# EAGLE board OpenWest 2015 (EAGLE 7.2.0), part 1 of 2
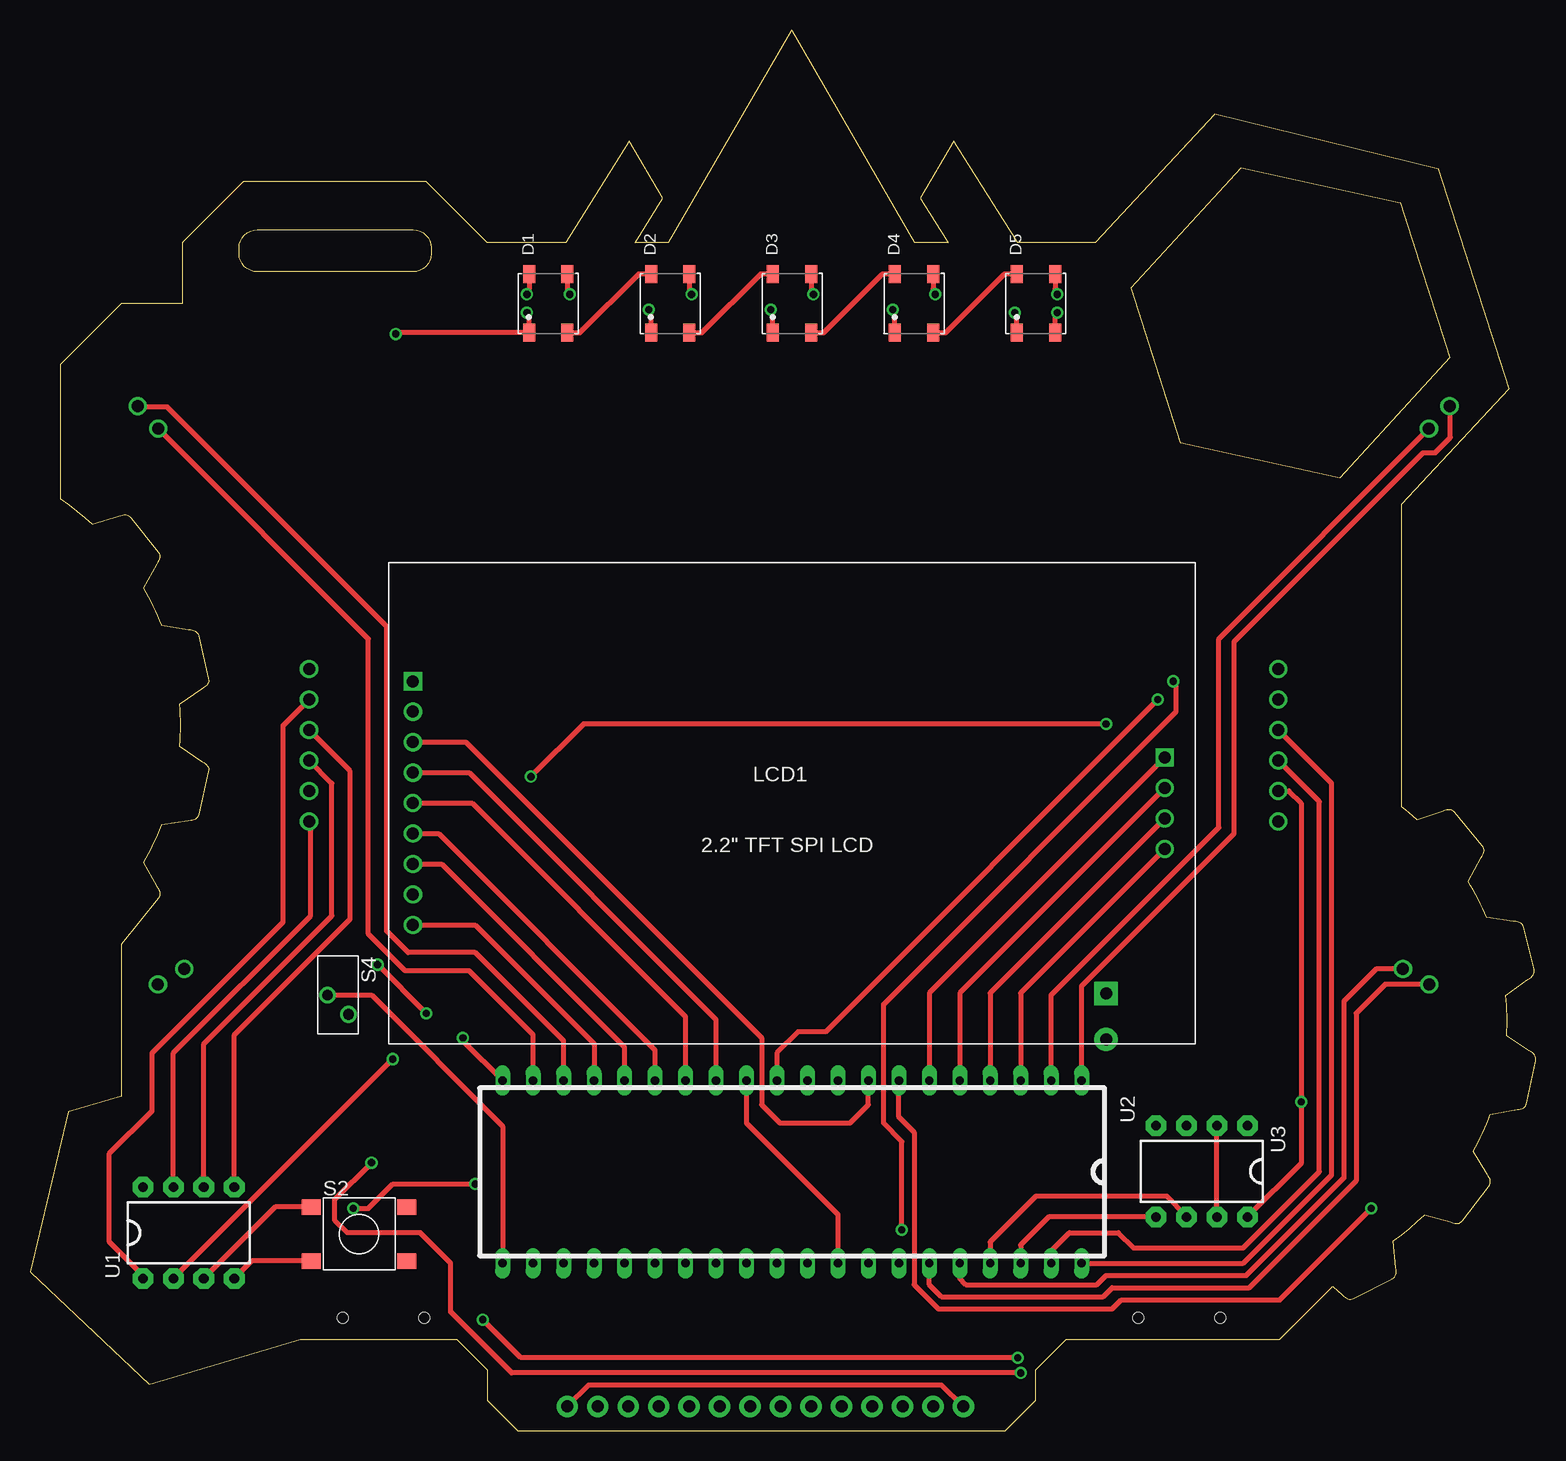
[diagram p1: board, top side]
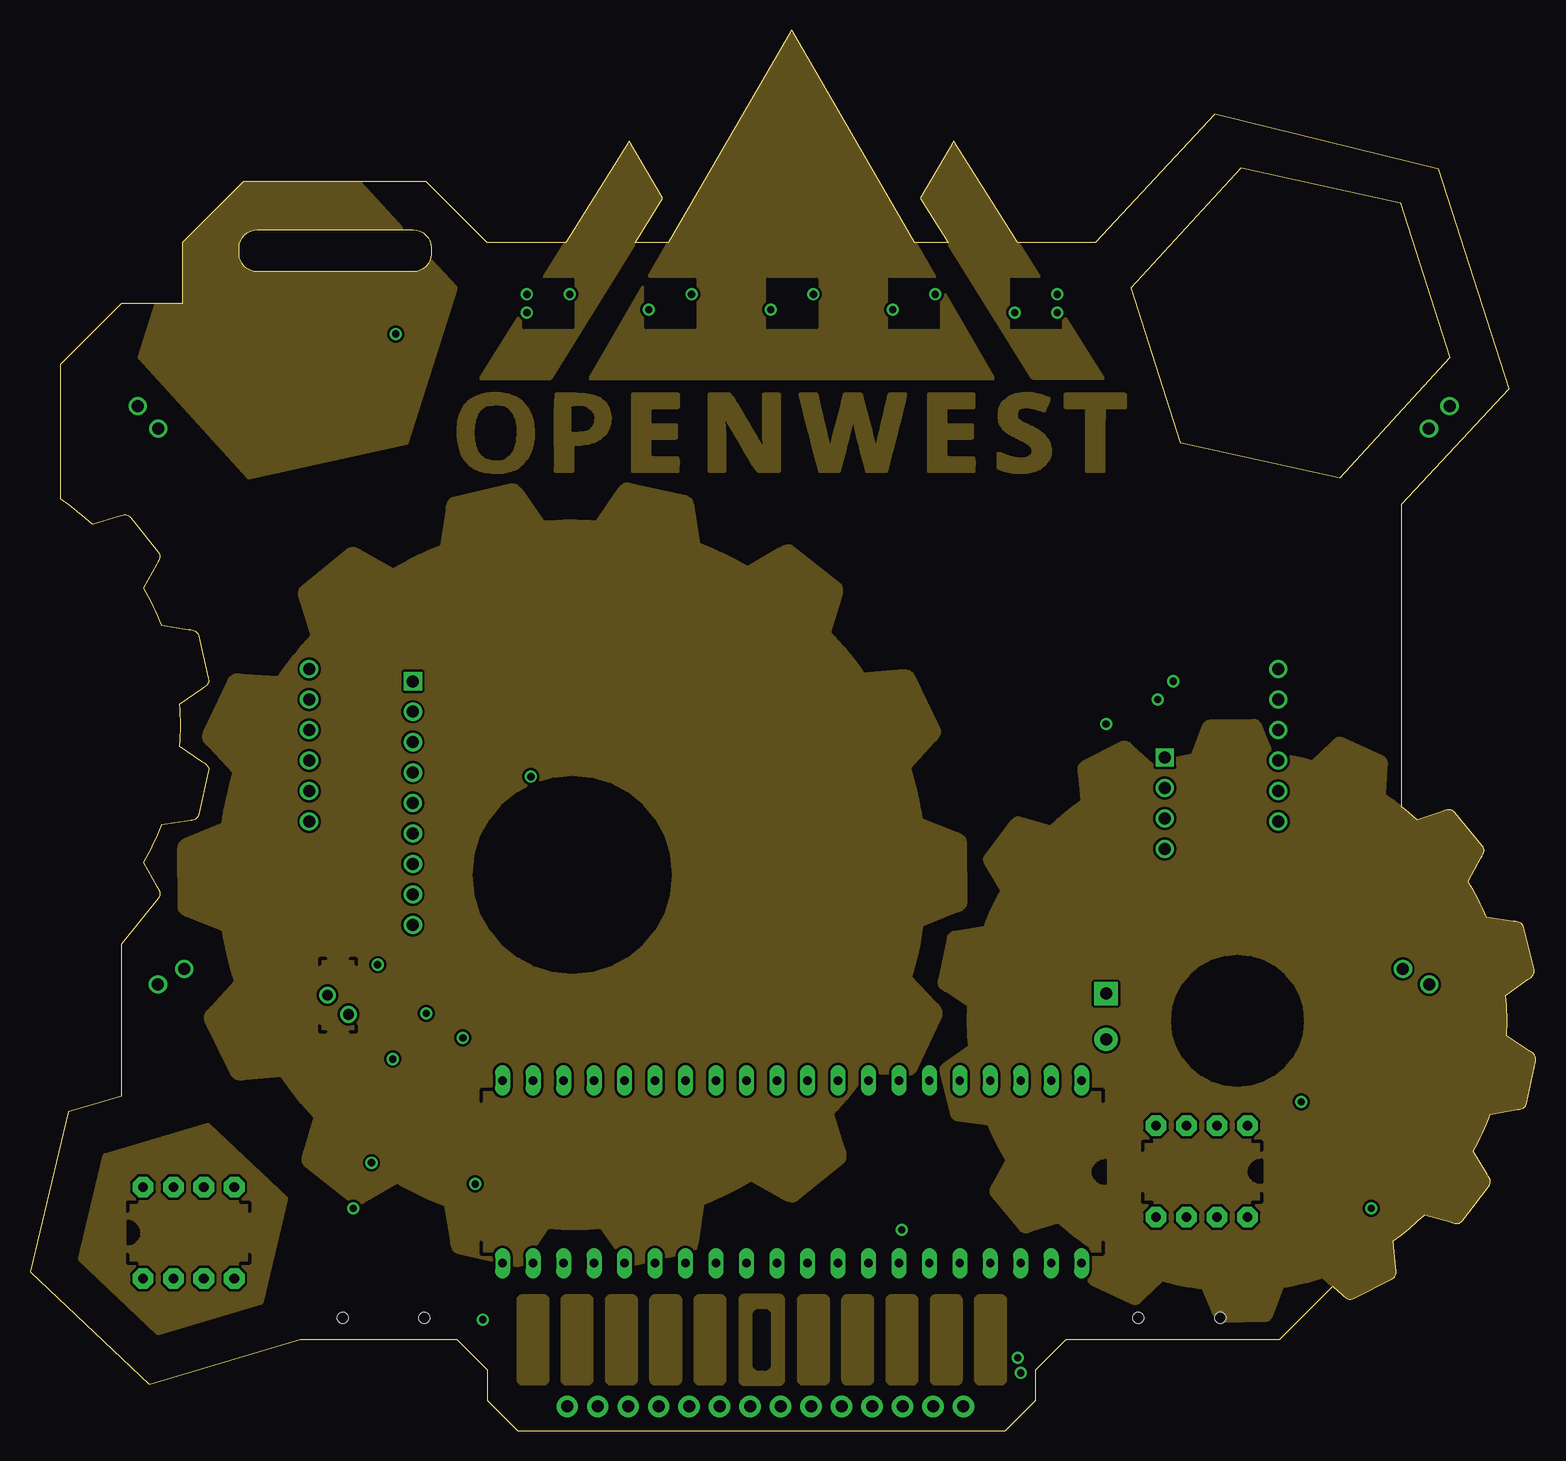
[diagram p2: board, inner layer Route2]
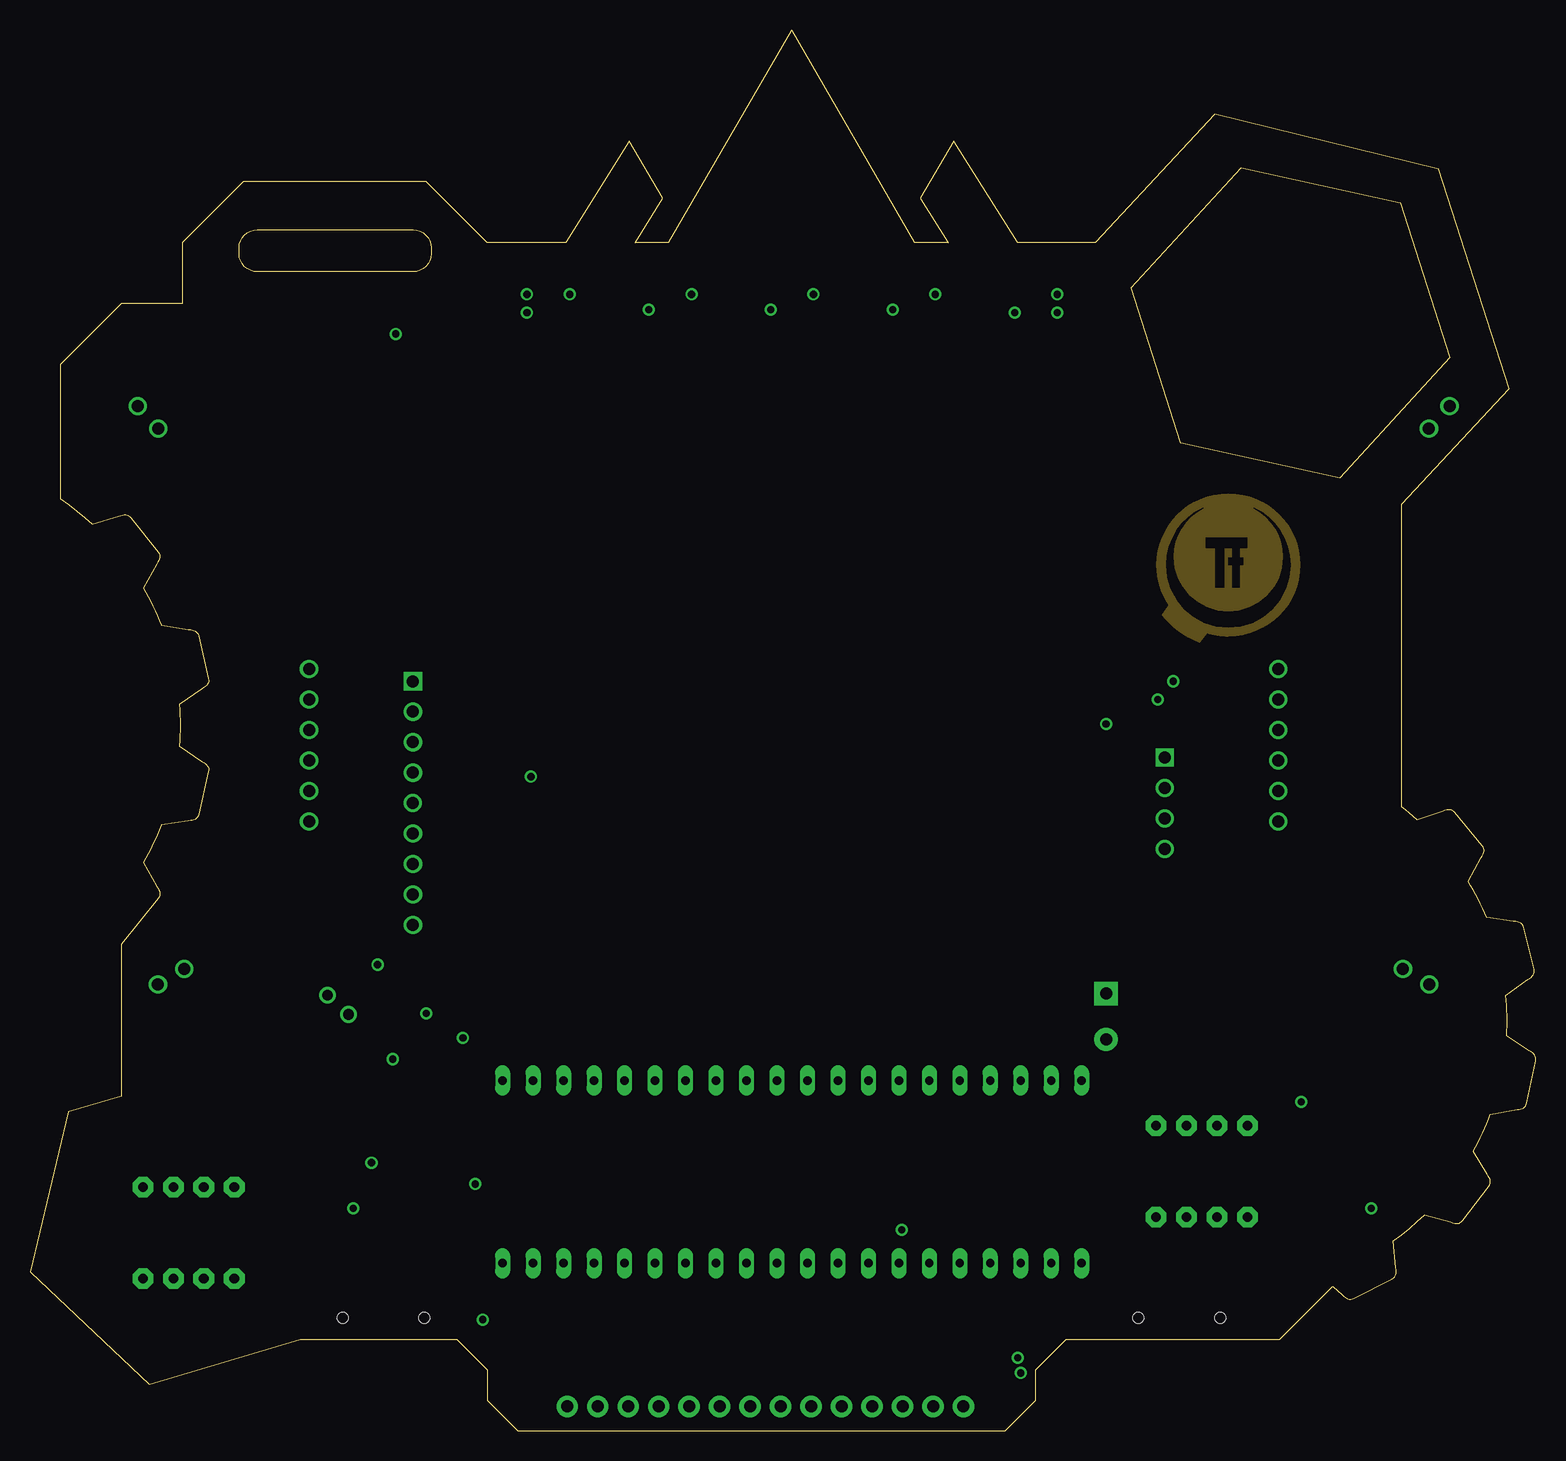
[diagram p3: board, inner layer Route14]
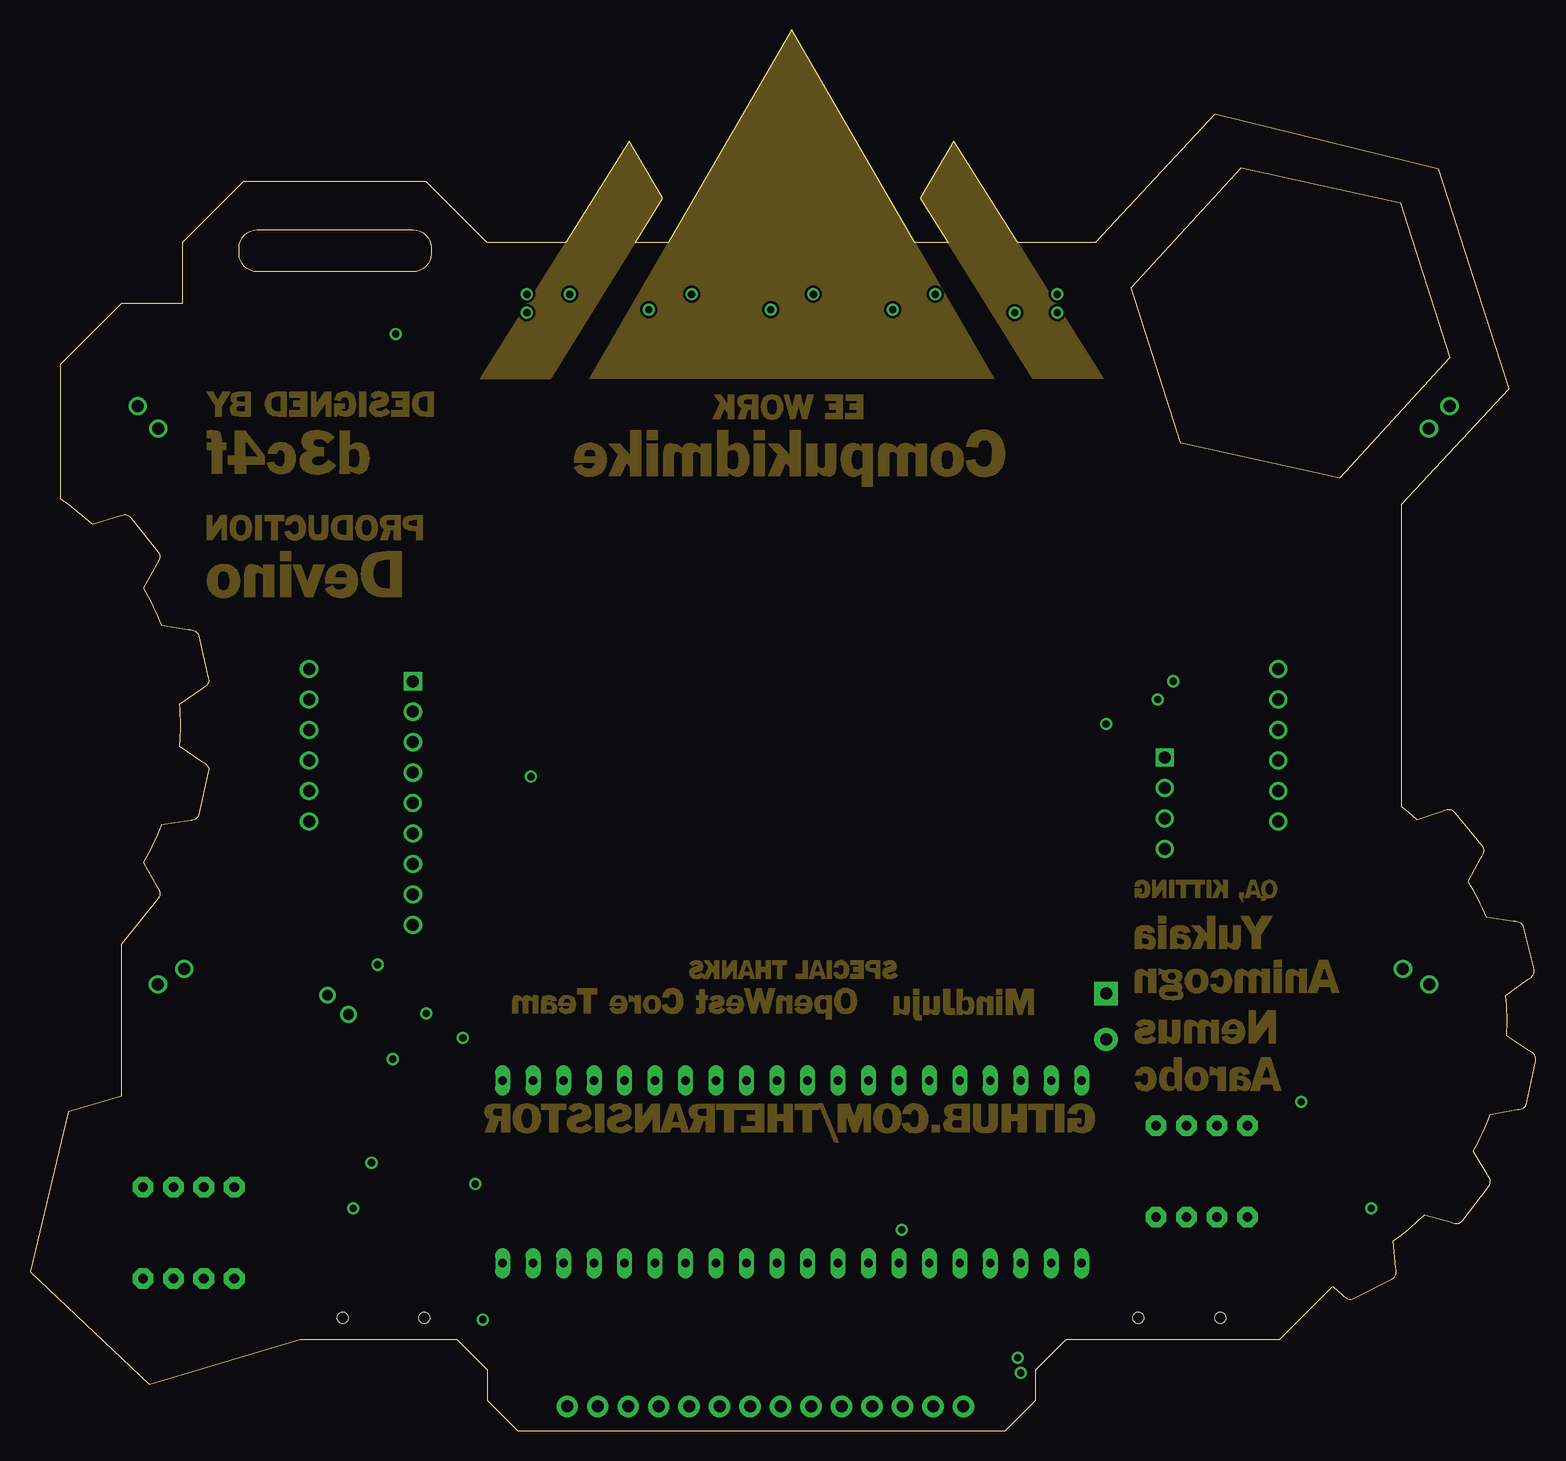
[diagram p4: board, inner layer Route15]
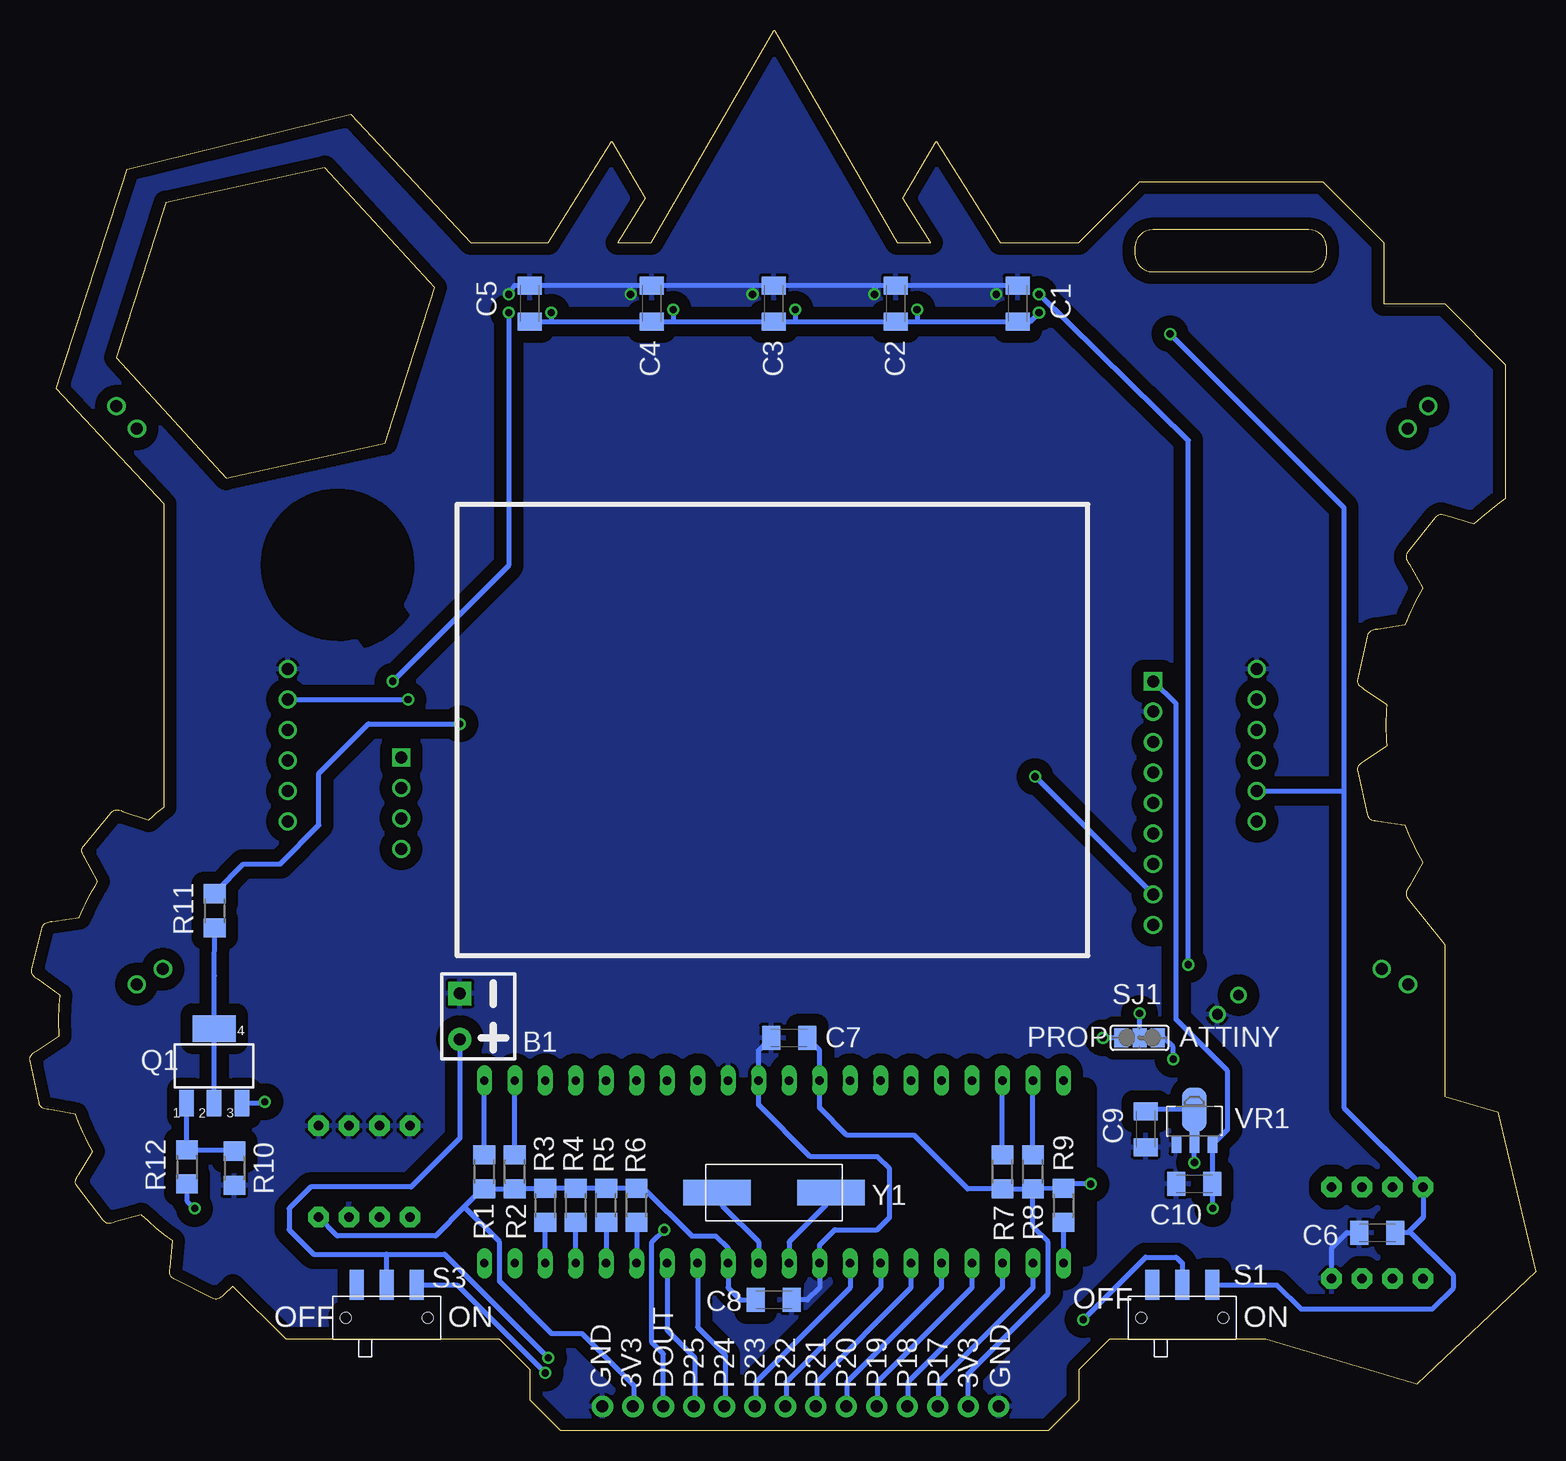
[diagram p5: board, bottom side, seen from below]

Size 125.5 x 116.78 mm. Coordinates in mm from the lower left corner, seen from the top.
Outline: 307 segments
Copper layers (1+2*14+15+16): Top 0.035mm / dielectric 1.5mm / Route2 0.035mm / dielectric 0.15mm / Route14 0.035mm / dielectric 0.15mm / Route15 0.035mm / dielectric 0.2mm / Bottom 0.035mm
Design rules "default *": minimum track width 10mil, minimum drill 12mil, track to track 8mil, track to pad 8mil, pad to pad 8mil, via to via 8mil, smd to smd 8mil, copper to edge 0.002540625mm, drill to drill 8mil, minimum pad ring 10mil, minimum via ring 8mil, stop-mask expansion 4mil, vias tented up to drill 0mil, thermal gap 10mil
bRestrict: area 37.6,14.7 to 89.4,28.4

## Footprints (pad centres in the part's own frame; a part is rotated, then mirrored left to right if it is on the bottom)
FLYING-LEADS = drill 1 pad 1.93: + 1.905,0 | drill 1 pad 1.93 square: - -1.905,0
C1206K = smd 1.5 x 2: 1 -1.5,0; 2 1.5,0
WS2812B = smd 1.5 x 1: 1 -2.45,1.6; 2 -2.45,-1.6; 3 2.45,-1.6; 4 2.45,1.6
BUTTON-BRD = drill 1: 1 -6.686,25.725; 2 -8.396,23.846; 3 -20.955,3.81; 4 -20.955,1.27; 5 -20.955,-1.27; 6 -20.955,-3.81; 7 -20.955,-6.35; 8 -20.955,-8.89; 9 -10.564,-21.188; 10 -8.367,-22.462
IOIO = drill 1 pad 1.778: P$1 -15.24,0; P$2 -12.7,0; P$3 -10.16,0; P$4 -7.62,0; P$5 -5.08,0; P$6 -2.54,0; P$7 0,0; P$8 2.54,0; P$9 5.08,0; P$10 7.62,0; P$11 10.16,0; P$12 12.7,0; P$13 15.24,0; P$14 17.78,0
2.2TFT = drill 1: CS -31.598,5.08; D/C -31.6,0; GND -31.598,7.62; LED -31.598,-7.62; MISO -31.598,-10.16; MOSI -31.598,-2.54; RST -31.598,2.54; SCK -31.598,-5.08; SD_MISO 31.064,-1.27; SD_MOSI 31.064,1.27; SD_SCK 31.064,-3.81 | drill 1 square: SD_CS 31.064,3.81; VCC -31.598,10.16
SOT223 = smd 1.219 x 2.235: 1 -2.311,-3.099; 2 0,-3.099; 3 2.311,-3.099 | smd 3.6 x 2.2: 4 0,3.099
R1206 = smd 1.6 x 1.803: 1 -1.422,0; 2 1.422,0
SAQN = smd 1.2 x 2.5: 1 -2.5,1.25; 2 0,1.25; 3 2.5,1.25 | hole 0.9: -3.4,-1.5; 3.4,-1.5
TACT-SMD = smd 1.55 x 1.3: P$1 -3.98,2.25; P$2 3.98,2.25; P$3 -3.98,-2.25; P$4 3.98,-2.25
SPST = drill 0.9: 1 0,-0.875; 2 1.6,0.875
PAD-JUMPER-3-2OF3_NC_BY_TRACE_YES_SILK_LARGE = smd 1.168 x 1.6: 1 -1.524,0; 2 0,0; 3 1.524,0
DIP08 = drill 0.813 pad 1.727 octagon: 1 -3.81,-3.81; 2 -1.27,-3.81; 3 1.27,-3.81; 4 3.81,-3.81; 5 3.81,3.81; 6 1.27,3.81; 7 -1.27,3.81; 8 -3.81,3.81
DIP-40 = drill 0.7 pad 1.27 long: 1 -7.62,24.13; 2 -7.62,21.59; 3 -7.62,19.05; 4 -7.62,16.51; 5 -7.62,13.97; 6 -7.62,11.43; 7 -7.62,8.89; 8 -7.62,6.35; 9 -7.62,3.81; 10 -7.62,1.27; 11 -7.62,-1.27; 12 -7.62,-3.81; 13 -7.62,-6.35; 14 -7.62,-8.89; 15 -7.62,-11.43; 16 -7.62,-13.97; 17 -7.62,-16.51; 18 -7.62,-19.05; 19 -7.62,-21.59; 20 -7.62,-24.13; 21 7.62,-24.13; 22 7.62,-21.59; 23 7.62,-19.05; 24 7.62,-16.51; 25 7.62,-13.97; 26 7.62,-11.43; 27 7.62,-8.89; 28 7.62,-6.35; 29 7.62,-3.81; 30 7.62,-1.27; 31 7.62,1.27; 32 7.62,3.81; 33 7.62,6.35; 34 7.62,8.89; 35 7.62,11.43; 36 7.62,13.97; 37 7.62,16.51; 38 7.62,19.05; 39 7.62,21.59; 40 7.62,24.13
SOT150P400X160-4N = smd 0.8 x 1.4: 1 -1.499,-1.981; 3 1.499,-1.981 | smd 0.8 x 1.9: 2 0,-1.727 | smd 2.032 x 3.65: 4 0,0.94
CRYSTAL-SMD = smd 5.6 x 2.1: P$1 -4.75,0; P$2 4.75,0

## Placement (x,y rotation side)
B1  3AAA  [FLYING-LEADS]  89.67,34.54 270 bottom
C1  0.1uF  [C1206K]  43.19,93.98 90 bottom
C2  0.1uF  [C1206K]  53.35,93.98 90 bottom
C3  0.1uF  [C1206K]  63.51,93.98 90 bottom
C4  0.1uF  [C1206K]  73.67,93.98 90 bottom
C5  0.1uF  [C1206K]  83.83,93.98 90 bottom
C6  0.1uF  [C1206K]  13.22,16.51 180 bottom
C7  0.1uF  [C1206K]  62.24,32.77 180 bottom
C8  0.1uF  [C1206K]  63.51,10.92 0 bottom
C9  1uF  [C1206K]  32.52,25.15 270 bottom
C10  1uF  [C1206K]  28.46,20.57 180 bottom
D1  [WS2812B]  43.19,93.98 90 top
D2  [WS2812B]  53.35,93.98 90 top
D3  [WS2812B]  63.51,93.98 90 top
D4  [WS2812B]  73.67,93.98 90 top
D5  [WS2812B]  83.83,93.98 90 top
J1  BUTTON-BRD  [BUTTON-BRD]  124.98,59.69 0 top
J2  BUTTON-BRD  [BUTTON-BRD]  2.3,59.69 0 bottom
J3  IOIO  [IOIO]  60.01,2.03 0 top
LCD1  2.2TFT  [2.2TFT]  63.51,52.32 0 top
Q1  BSP170P  [SOT223]  110.15,30.42 0 bottom
R1  10K  [R1206]  87.64,21.59 270 bottom
R2  10K  [R1206]  85.1,21.59 270 bottom
R3  10K  [R1206]  82.56,18.8 90 bottom
R4  10K  [R1206]  80.02,18.8 90 bottom
R5  10K  [R1206]  77.48,18.8 270 bottom
R6  10K  [R1206]  74.94,18.8 270 bottom
R7  10K  [R1206]  44.46,21.59 270 bottom
R8  10K  [R1206]  41.92,21.59 270 bottom
R9  10K  [R1206]  39.38,18.8 90 bottom
R10  10K  [R1206]  108.47,21.89 90 bottom
R11  10R  [R1206]  110.1,43.35 90 bottom
R12  10R  [R1206]  112.42,22.01 90 bottom
S1  JS102011SAQN  [SAQN]  29.47,10.92 0 bottom
S2  TACT-SMD  [TACT-SMD]  27.42,16.41 0 top
S3  JS102011SAQN  [SAQN]  95.77,10.92 0 bottom
S4  RB-220-07  [SPST]  25.66,36.32 270 top
SJ1  JUMPER-PAD-3-2OF3_NC_BY_TRACE_LARGE  [PAD-JUMPER-3-2OF3_NC_BY_TRACE_YES_SILK_LARGE]  33.03,32.77 0 bottom
U1  TINY85-20-DIP  [DIP08]  13.22,16.51 0 top
U2  P8X32A-D40  [DIP-40]  63.51,21.59 270 top
U3  24LC256  [DIP08]  97.64,21.63 180 top
VR1  [SOT150P400X160-4N]  28.46,25.84 0 bottom
Y1  5MHz  [CRYSTAL-SMD]  63.5,19.86 180 bottom

## Tracks (layer width: path | path; a pad name or v marks a point on that pad's centre or on a via)
+3V3  (via drill 0.6)
  Top 0.406: U2.12 59.7,25.65 67.32,18.03 U2.32 | v26.93,18.54 28.2,18.54 30.24,20.57 v37.09,20.57 | J1.7 104.91,53.34 105.93,52.32 v105.93,27.43 105.93,22.29 U3.8
  Bottom 0.406: C8.1 66.3,10.92 67.32,11.94 U2.32 67.32,15.24 68.34,16.26 70.37,16.26 74.33,20.22 R6.1 R5.1 R4.2 R3.2 85.1,20.22 R2.2 R1.2 87.64,20.32 89.29,18.67 | C7.1 59.7,31.73 U2.12 59.7,26.92 57.41,24.64 51.83,24.64 47.36,20.17 R7.2 R8.2 | 89.29,18.67 91.7,16.26 99.89,16.26 U3.8 | v26.93,18.54 26.96,18.57 C10.1 VR1.3 26.93,23.88 25.69,25.12 25.69,30 29.98,34.29 29.98,60.6 LCD1.VCC | v37.09,20.57 39.28,20.57 R9.2 R8.2 | Q1.3 106.04,27.32 v105.93,27.43 | J3.P$2 47.31,4.77 40.65,11.43 40.65,15.75 41.92,17.02 R8.2 | R8.2 41.92,20.32 | 89.29,18.67 86.37,15.75 86.37,12.45 82.05,8.13 79.51,8.13 75.19,3.81 75.19,2.09 J3.P$13
A
  Top 0.406: U2.18 44.46,32.51 37.09,39.88 31.51,39.88 29.73,41.66 29.73,67.06 11.44,85.34 9.05,85.34 J2.1
  Bottom 0.406: R7.1 U2.18
B
  Top 0.406: U2.19 41.92,33.02 36.59,38.35 31.25,38.35 28.2,41.4 28.2,66.02 J2.2
  Bottom 0.406: R8.1 U2.19
BACKL  (via drill 0.6)
  Top 0.406: v89.67,58.93 46.14,58.93 v41.74,54.53
  Bottom 0.406: R11.2 109.99,44.96 107.71,47.24 104.66,47.24 101.42,50.49 101.42,54.8 97.29,58.93 v89.67,58.93 | v41.74,54.53 LCD1.LED
BACKLCTRL  (via drill 0.6)
  Top 0.406: U2.7 72.4,26.16 73.67,24.89 73.67,12.19 75.7,10.16 90.18,10.16 90.94,10.92 104.15,10.92 v111.77,18.54
  Bottom 0.406: R12.1 112.42,19.19 v111.77,18.54
D
  Top 0.406: U2.2 85.1,36.32 99.07,50.29 99.07,66.02 J1.2
  Bottom 0.406: R2.1 U2.2
GND  (via drill 0.6)
  Top 0.406: D2.3 54.95,95.17 v55.13,94.74 | D3.3 65.11,95.17 v65.29,94.74 | D1.3 44.79,95.17 v44.97,94.74 | D4.3 75.27,95.17 v75.45,94.74 | D5.3 85.43,95.17 v85.61,94.74 | S2.P$3 18.49,14.16 U1.4 | J3.P$14 77.74,2.03 75.96,3.81 46.55,3.81 J3.P$1 | U3.7 U3.2
  Bottom 0.406: C8.2 60.72,10.92 59.7,11.94 U2.29 59.7,15.49 58.43,16.76 54.87,16.76 53.86,17.78 53.86,21.84 54.87,22.86 60.46,22.86 64.78,27.18 U2.10 64.78,31.73 C7.2 | C1.2 44.97,95.48 | 44.97,95.48 C2.2 54.87,95.48 | 54.87,95.48 C3.2 65.29,95.48 | 65.29,95.48 C4.2 75.45,95.48 | 75.45,95.48 C5.2 85.12,95.48 v85.61,94.74 | v55.13,94.74 55.13,95.23 54.87,95.48 | v65.29,94.74 65.29,95.48 | v44.97,94.74 44.97,95.48 | v75.45,94.74 75.45,95.48 | U1.4 17.03,15.24 15.76,16.51 C6.2
  pour Bottom (isolate 1.016): -1.26,118.62 128.03,118.62 128.03,-0.51 -1.26,-0.51
L
  Top 0.406: J1.9 112.17,38.5 109.48,35.81 109.48,21.08 101.36,12.95 89.67,12.95 88.91,12.19 77.99,12.19 77.48,12.7 U2.36
  Bottom 0.406: R5.2 U2.36
LED-DOUT  (via drill 0.6)
  Top 0.406: v72.65,16.76 72.65,24.13 71.13,25.65 71.13,35.56 95.51,59.94 95.51,62.23 v95.26,62.48 | 85.35,91.45 D5.2 85.43,93.04 v85.61,93.22
  Bottom 0.406: J3.P$12 72.71,6.41 73.67,7.37 73.67,15.75 v72.65,16.76 | v85.61,93.22 85.61,72.14 v95.26,62.48
MISO
  Top 0.406: U1.6 14.49,32.26 25.16,42.93 25.16,53.98 J2.6
MOSI
  Top 0.406: U1.5 17.03,33.02 26.68,42.67 26.68,54.99 J2.5
N$1  (via drill 0.6)
  Top 0.406: v33.03,34.8 v28.97,38.86 | D1.4 41.59,95.17 v41.41,94.74
  Bottom 0.406: SJ1.2 v33.03,34.8 | v28.97,38.86 28.97,82.55 v41.41,94.74
N$2
  Top 0.406: D1.2 45.82,91.53 50.72,96.43 D2.4
N$3
  Top 0.406: D2.2 55.98,91.53 60.88,96.43 D3.4
N$4
  Top 0.406: D3.2 66.14,91.53 71.04,96.43 D4.4
N$5
  Top 0.406: D4.2 76.3,91.53 81.2,96.43 D5.4
N$6
  Top 0.406: U3.6 96.37,17.94 94.75,19.56 83.83,19.56 80.02,15.75 U2.37
  Bottom 0.406: U2.37 R4.1
N$7
  Top 0.406: U3.5 84.89,17.82 82.56,15.49 U2.38
  Bottom 0.406: U2.38 R3.1
N$8  (via drill 0.6)
  Top 0.406: U1.2 v30.24,30.99
  Bottom 0.406: v30.24,30.99 30.24,32 31,32.77 SJ1.3
N$9  (via drill 0.6)
  Top 0.406: v36.08,32.77 36.08,32.51 U2.20
  Bottom 0.406: SJ1.1 v36.08,32.77
N$10
  Top 0.406: LCD1.CS 36.33,57.4 60.97,32.77 60.97,27.18 62.49,25.65 68.34,25.65 69.86,27.18 U2.8
N$11
  Top 0.406: LCD1.RST 36.59,54.86 57.16,34.29 U2.13
N$12
  cutout Route2: 100.62,28.78 99.53,28.89 98.52,29.2 97.6,29.7 96.8,30.36 96.14,31.16 95.64,32.08 95.32,33.1 95.21,34.19 95.32,35.28 95.64,36.29 96.14,37.21 96.8,38.01 97.6,38.67 98.52,39.17 99.53,39.48 100.62,39.59 101.71,39.48 102.73,39.17 103.65,38.67 104.45,38.01 105.11,37.21 105.61,36.29 105.92,35.28 106.03,34.19 105.92,33.1 105.61,32.08 105.11,31.16 104.45,30.36 103.65,29.7 102.73,29.2 101.71,28.89
N$13
  Top 0.406: LCD1.D/C 36.84,52.32 54.62,34.54 U2.14
N$14
  Top 0.406: LCD1.MOSI 34.05,49.78 52.08,31.75 U2.15
N$15
  Top 0.406: LCD1.SCK 34.3,47.24 49.54,32 U2.16
N$16
  Top 0.406: LCD1.MISO 37.09,42.16 47,32.26 U2.17
N$17
  cutout Route2: 51.57,96.01 55.38,96.01 55.38,91.95 51.32,91.95 51.32,96.01
N$18
  cutout Route2: 61.48,96.01 65.54,96.01 65.54,91.95 61.48,91.95
N$19
  cutout Route2: 71.64,96.01 75.7,96.01 75.7,91.95 71.64,91.95
N$20
  cutout Route2: 81.8,96.01 85.86,96.01 85.86,91.95 81.8,91.95
N$21
  Bottom 0.406: Y1.P$1 59.2,18.79 62.24,15.75 U2.30
N$22
  Bottom 0.406: Y1.P$2 67.8,18.77 64.78,15.75 U2.31
N$23
  pour Route2: 362 corners
N$24
  cutout Route2: 45.2,38.18 43.55,38.34 42.01,38.82 40.63,39.57 39.42,40.57 38.42,41.78 37.66,43.17 37.19,44.7 37.02,46.35 37.19,48 37.66,49.53 38.42,50.92 39.42,52.13 40.63,53.13 42.01,53.88 43.55,54.36 45.2,54.52 46.84,54.36 48.38,53.88 49.77,53.13 50.97,52.13 51.97,50.92 52.73,49.53 53.2,48 53.37,46.35 53.2,44.7 52.73,43.17 51.97,41.78 50.97,40.57 49.77,39.57 48.38,38.82 46.84,38.34
N$25
  pour Route2 (no thermals): 378 corners
N$26
  pour Route2: 43.13,4.24 43.13,4.17 43.11,4.1 43.08,4.05 43.03,3.99 42.98,3.95 42.93,3.92 42.86,3.9 42.79,3.89 41.02,3.89 40.95,3.9 40.88,3.92 40.82,3.95 40.77,3.99 40.73,4.05 40.7,4.1 40.68,4.17 40.67,4.24 40.67,10.94 40.68,11 40.7,11.07 40.73,11.13 40.77,11.18 40.82,11.22 40.88,11.25 40.95,11.27 41.02,11.28 42.79,11.28 42.86,11.27 42.93,11.25 42.98,11.22 43.03,11.18 43.08,11.13 43.11,11.07 43.13,11 43.13,10.94
N$27
  pour Route2: 46.83,4.24 46.82,4.17 46.8,4.1 46.77,4.05 46.73,3.99 46.68,3.95 46.62,3.92 46.55,3.9 46.48,3.89 44.71,3.89 44.64,3.9 44.57,3.92 44.52,3.95 44.46,3.99 44.42,4.05 44.39,4.1 44.37,4.17 44.36,4.24 44.36,10.94 44.37,11 44.39,11.07 44.42,11.13 44.46,11.18 44.52,11.22 44.57,11.25 44.64,11.27 44.71,11.28 46.48,11.28 46.55,11.27 46.62,11.25 46.68,11.22 46.73,11.18 46.77,11.13 46.8,11.07 46.82,11 46.83,10.94
N$28
  pour Route2: 50.52,4.24 50.51,4.17 50.49,4.1 50.46,4.05 50.42,3.99 50.37,3.95 50.31,3.92 50.24,3.9 50.18,3.89 48.4,3.89 48.33,3.9 48.27,3.92 48.21,3.95 48.16,3.99 48.11,4.05 48.08,4.1 48.06,4.17 48.06,4.24 48.06,10.94 48.06,11 48.08,11.07 48.11,11.13 48.16,11.18 48.21,11.22 48.27,11.25 48.33,11.27 48.4,11.28 50.18,11.28 50.24,11.27 50.31,11.25 50.37,11.22 50.42,11.18 50.46,11.13 50.49,11.07 50.51,11 50.52,10.94
N$29
  pour Route2: 54.21,4.24 54.2,4.17 54.18,4.1 54.15,4.05 54.11,3.99 54.06,3.95 54,3.92 53.94,3.9 53.87,3.89 52.09,3.89 52.02,3.9 51.96,3.92 51.9,3.95 51.85,3.99 51.81,4.05 51.77,4.1 51.75,4.17 51.75,4.24 51.75,10.94 51.75,11 51.77,11.07 51.81,11.13 51.85,11.18 51.9,11.22 51.96,11.25 52.02,11.27 52.09,11.28 53.87,11.28 53.94,11.27 54,11.25 54.06,11.22 54.11,11.18 54.15,11.13 54.18,11.07 54.2,11 54.21,10.94
N$30
  pour Route2: 57.9,4.24 57.89,4.17 57.87,4.1 57.84,4.05 57.8,3.99 57.75,3.95 57.69,3.92 57.63,3.9 57.56,3.89 55.78,3.89 55.71,3.9 55.65,3.92 55.59,3.95 55.54,3.99 55.5,4.05 55.47,4.1 55.45,4.17 55.44,4.24 55.44,10.94 55.45,11 55.47,11.07 55.5,11.13 55.54,11.18 55.59,11.22 55.65,11.25 55.71,11.27 55.78,11.28 57.56,11.28 57.63,11.27 57.69,11.25 57.75,11.22 57.8,11.18 57.84,11.13 57.87,11.07 57.89,11 57.9,10.94
N$31
  pour Route2: 66.51,4.24 66.51,4.17 66.49,4.1 66.46,4.05 66.41,3.99 66.36,3.95 66.31,3.92 66.24,3.9 66.17,3.89 64.4,3.89 64.33,3.9 64.26,3.92 64.2,3.95 64.15,3.99 64.11,4.05 64.08,4.1 64.06,4.17 64.05,4.24 64.05,10.94 64.06,11 64.08,11.07 64.11,11.13 64.15,11.18 64.2,11.22 64.26,11.25 64.33,11.27 64.4,11.28 66.17,11.28 66.24,11.27 66.31,11.25 66.36,11.22 66.41,11.18 66.46,11.13 66.49,11.07 66.51,11 66.51,10.94
N$32
  pour Route2: 70.21,4.24 70.2,4.17 70.18,4.1 70.15,4.05 70.11,3.99 70.06,3.95 70,3.92 69.93,3.9 69.87,3.89 68.09,3.89 68.02,3.9 67.95,3.92 67.9,3.95 67.84,3.99 67.8,4.05 67.77,4.1 67.75,4.17 67.74,4.24 67.74,10.94 67.75,11 67.77,11.07 67.8,11.13 67.84,11.18 67.9,11.22 67.95,11.25 68.02,11.27 68.09,11.28 69.87,11.28 69.93,11.27 70,11.25 70.06,11.22 70.11,11.18 70.15,11.13 70.18,11.07 70.2,11 70.21,10.94
N$33
  pour Route2: 73.9,4.24 73.89,4.17 73.87,4.1 73.84,4.05 73.8,3.99 73.75,3.95 73.69,3.92 73.62,3.9 73.56,3.89 71.78,3.89 71.71,3.9 71.65,3.92 71.59,3.95 71.54,3.99 71.49,4.05 71.46,4.1 71.44,4.17 71.44,4.24 71.44,10.94 71.44,11 71.46,11.07 71.49,11.13 71.54,11.18 71.59,11.22 71.65,11.25 71.71,11.27 71.78,11.28 73.56,11.28 73.62,11.27 73.69,11.25 73.75,11.22 73.8,11.18 73.84,11.13 73.87,11.07 73.89,11 73.9,10.94
N$34
  pour Route2: 77.59,4.24 77.58,4.17 77.56,4.1 77.53,4.05 77.49,3.99 77.44,3.95 77.38,3.92 77.32,3.9 77.25,3.89 75.47,3.89 75.4,3.9 75.34,3.92 75.28,3.95 75.23,3.99 75.19,4.05 75.16,4.1 75.14,4.17 75.13,4.24 75.13,10.94 75.14,11 75.16,11.07 75.19,11.13 75.23,11.18 75.28,11.22 75.34,11.25 75.4,11.27 75.47,11.28 77.25,11.28 77.32,11.27 77.38,11.25 77.44,11.22 77.49,11.18 77.53,11.13 77.56,11.07 77.58,11 77.59,10.94
N$35
  pour Route2: 81.28,4.24 81.27,4.17 81.25,4.1 81.22,4.05 81.18,3.99 81.13,3.95 81.07,3.92 81.01,3.9 80.94,3.89 79.16,3.89 79.09,3.9 79.03,3.92 78.97,3.95 78.92,3.99 78.88,4.05 78.85,4.1 78.83,4.17 78.82,4.24 78.82,10.94 78.83,11 78.85,11.07 78.88,11.13 78.92,11.18 78.97,11.22 79.03,11.25 79.09,11.27 79.16,11.28 80.94,11.28 81.01,11.27 81.07,11.25 81.13,11.22 81.18,11.18 81.22,11.13 81.25,11.07 81.27,11 81.28,10.94
N$36
  cutout Route2: 61.59,5.47 61.59,5.4 61.57,5.33 61.53,5.28 61.49,5.23 61.44,5.18 61.38,5.15 61.32,5.13 61.25,5.13 60.7,5.13 60.63,5.13 60.57,5.15 60.51,5.18 60.46,5.23 60.42,5.28 60.39,5.33 60.37,5.4 60.36,5.47 60.36,9.71 60.37,9.77 60.39,9.84 60.42,9.9 60.46,9.95 60.51,9.99 60.57,10.02 60.63,10.04 60.7,10.05 61.25,10.05 61.32,10.04 61.38,10.02 61.44,9.99 61.49,9.95 61.53,9.9 61.57,9.84 61.59,9.77 61.59,9.71
N$37
  pour Route2: 62.48,11.28 59.47,11.28 59.4,11.27 59.34,11.25 59.28,11.22 59.23,11.18 59.19,11.13 59.16,11.07 59.14,11 59.13,10.94 59.13,4.24 59.14,4.17 59.16,4.1 59.19,4.05 59.23,3.99 59.28,3.95 59.34,3.92 59.4,3.9 59.47,3.89 62.48,3.89 62.55,3.9 62.61,3.92 62.67,3.95 62.72,3.99 62.76,4.05 62.8,4.1 62.82,4.17 62.82,4.24 62.82,10.94 62.82,11 62.8,11.07 62.76,11.13 62.72,11.18 62.67,11.22 62.61,11.25 62.55,11.27
N$38
  pour Route2: 14.84,25.59 21.38,19.41 19.3,10.64 10.66,8.07 4.12,14.26 6.2,23.02
N$39
  pour Route2: 33.36,97.69 33.27,97.47 33.15,97.26 33,97.08 32.83,96.92 32.63,96.79 32.41,96.7 32.18,96.64 31.93,96.62 18.93,96.62 18.63,96.65 18.34,96.74 18.09,96.87 17.87,97.06 17.68,97.28 17.55,97.53 17.46,97.82 17.43,98.12 17.43,98.62 17.46,98.92 17.55,99.2 17.68,99.46 17.87,99.68 18.09,99.86 18.34,100 18.63,100.09 18.93,100.12 31.14,100.12 27.47,104.14 17.78,104.14 12.7,99.06 12.7,93.98 10.48,93.98 9.04,89.45 18.19,79.43 31.45,82.34 35.56,95.28
N$40
  pour Route2: 63.52,116.71 63.51,116.84 63.48,116.78 63.44,116.84 63.44,116.71 46.63,87.72 80.32,87.72
N$41
  pour Route2: 49.96,107.52 37.5,87.72 43.39,87.72 52.75,102.76
N$42
  pour Route2: 77,107.52 89.45,87.72 83.57,87.72 74.21,102.76
N$43
  cutout Route2: 46.75,83.79 46.9,84.13 46.92,84.45 46.84,84.74 46.66,84.98 46.39,85.17 46.06,85.29 45.66,85.33 45.22,85.27 45.22,83.38 45.71,83.4 46.15,83.45 46.34,83.5 46.51,83.56 46.65,83.66
N$44
  pour Route2: 45.22,82.21 45.22,79.96 43.79,79.96 43.8,80.77 43.8,81.59 43.79,82.41 43.78,83.24 43.78,84.06 43.79,84.87 43.81,85.67 43.84,86.45 44.68,86.47 45.49,86.47 46.23,86.42 46.9,86.3 47.46,86.07 47.9,85.73 48.2,85.23 48.34,84.56 48.31,83.99 48.15,83.49 47.89,83.07 47.53,82.72 47.07,82.46 46.52,82.28 45.9,82.2
N$45
  cutout Route2: 37.72,85.02 37.47,84.7 37.3,84.27 37.2,83.76 37.16,83.21 37.19,82.66 37.3,82.15 37.47,81.71 37.72,81.39 37.87,81.28 38.06,81.19 38.28,81.11 38.52,81.06 38.77,81.03 39.02,81.03 39.27,81.07 39.5,81.14 39.89,81.42 40.17,81.86 40.36,82.42 40.45,83.04 40.43,83.67 40.32,84.26 40.09,84.76 39.76,85.12 39.65,85.18 39.54,85.24 39.43,85.28 39.3,85.31 39.02,85.33 38.69,85.32 38.37,85.29 38.11,85.24 38,85.2 37.9,85.15 37.8,85.09
N$46
  pour Route2: 38.38,86.5 39.17,86.52 39.87,86.4 40.48,86.15 40.99,85.78 41.4,85.3 41.7,84.71 41.89,84.01 41.95,83.23 41.93,82.72 41.85,82.23 41.73,81.78 41.56,81.36 41.34,80.99 41.08,80.66 40.77,80.38 40.42,80.17 39.98,80 39.49,79.89 38.97,79.85 38.45,79.86 37.94,79.94 37.47,80.07 37.04,80.25 36.69,80.47 36.3,80.91 36,81.47 35.8,82.11 35.69,82.8 35.68,83.49 35.75,84.16 35.9,84.77 36.13,85.27 36.32,85.53 36.53,85.76 36.78,85.96 37.05,86.12 37.35,86.26 37.67,86.37 38.02,86.45
N$47
  pour Route2: 84.94,86.09 84.91,85.93 84.86,85.79 84.8,85.66 84.74,85.53 84.68,85.4 84.62,85.26 84.57,85.12 84.54,84.97 84.3,85.06 83.96,85.17 83.55,85.27 83.13,85.33 82.74,85.32 82.42,85.22 82.22,84.99 82.19,84.61 82.24,84.43 82.35,84.28 82.51,84.15 82.69,84.04 83.12,83.84 83.57,83.64 83.88,83.45 84.2,83.22 84.5,82.95 84.75,82.63 84.94,82.27 85.03,81.86 85,81.42 84.84,80.93 84.56,80.54 84.17,80.23 83.68,80.02 83.12,79.89 82.52,79.85 81.9,79.89 81.29,80.02 80.71,80.22 80.71,81.55 81,81.42 81.35,81.29 81.74,81.17 82.15,81.08 82.55,81.03 82.94,81.06 83.28,81.17 83.57,81.39 83.58,81.65 83.54,81.87 83.45,82.05 83.31,82.2 83.14,82.33 82.94,82.45 82.72,82.56 82.49,82.67 82.18,82.82 81.88,82.98 81.6,83.14 81.34,83.33 81.12,83.55 80.94,83.81 80.82,84.13 80.76,84.51 80.82,85.22 81.1,85.77 81.55,86.16 82.13,86.41 82.8,86.52 83.52,86.49 84.25,86.35
N$48
  pour Route2: 54,86.45 54,85.27 51.71,85.27 51.67,85.13 51.65,84.97 51.65,84.8 51.65,84.62 51.66,84.25 51.65,83.9 53.85,83.9 53.85,82.72 51.65,82.72 51.65,81.19 51.91,81.15 52.19,81.14 52.48,81.13 52.77,81.13 53.37,81.14 53.95,81.14 53.98,81.02 54,80.88 54.01,80.74 54.01,80.58 54,80.27 54,79.96 50.22,79.96 50.22,86.45
N$49
  pour Route2: 58.29,86.45 58.51,86.18 58.71,85.89 58.88,85.58 59.06,85.27 59.32,84.83 59.58,84.38 59.84,83.92 60.11,83.47 60.38,83.01 60.65,82.55 60.92,82.1 61.2,81.65 61.17,82.22 61.15,82.81 61.14,83.41 61.15,84.02 61.15,84.63 61.15,85.24 61.16,85.85 61.15,86.45 62.43,86.45 62.43,79.96 60.69,79.96 60.57,80.09 60.47,80.23 60.37,80.37 60.27,80.52 60.1,80.83 59.92,81.14 59.67,81.59 59.4,82.04 59.14,82.5 58.87,82.97 58.6,83.43 58.33,83.9 58.05,84.36 57.78,84.81 57.83,84.24 57.86,83.65 57.88,83.05 57.88,82.44 57.89,81.82 57.88,81.2 57.88,80.58 57.88,79.96 56.61,79.96 56.61,86.45
N$50
  pour Route2: 64.16,86.45 65.54,86.45 65.68,85.83 65.83,85.22 65.98,84.6 66.12,83.99 66.27,83.38 66.41,82.76 66.54,82.13 66.67,81.5 66.8,82.13 66.95,82.76 67.11,83.37 67.27,83.98 67.43,84.59 67.59,85.2 67.75,85.82 67.89,86.45 69.27,86.45 69.41,85.82 69.57,85.22 69.73,84.61 69.9,84.01 70.06,83.41 70.21,82.79 70.34,82.16 70.44,81.5 70.6,82.11 70.75,82.72 70.9,83.34 71.04,83.96 71.18,84.58 71.33,85.21 71.47,85.83 71.62,86.45 73,86.45 72.81,85.62 72.61,84.81 72.4,84 72.2,83.19 71.98,82.39 71.77,81.58 71.57,80.78 71.36,79.96 69.73,79.96 69.59,80.55 69.44,81.13 69.29,81.71 69.13,82.28 68.98,82.85 68.84,83.44 68.71,84.04 68.61,84.66 68.47,84.06 68.33,83.47 68.18,82.89 68.03,82.3 67.88,81.72 67.73,81.14 67.58,80.55 67.43,79.96 65.8,79.96 65.6,80.78 65.39,81.59 65.18,82.39 64.97,83.19 64.76,84 64.55,84.81 64.35,85.62
N$51
  pour Route2: 78.66,86.45 78.66,85.27 76.37,85.27 76.33,85.13 76.31,84.97 76.31,84.8 76.31,84.62 76.32,84.25 76.31,83.9 78.51,83.9 78.51,82.72 76.31,82.72 76.31,81.19 76.57,81.15 76.85,81.14 77.14,81.13 77.43,81.13 78.03,81.14 78.61,81.14 78.65,81.02 78.66,80.88 78.67,80.74 78.67,80.58 78.66,80.27 78.66,79.96 74.89,79.96 74.89,86.45
N$52
  pour Route2: 91.22,86.45 91.26,86.33 91.27,86.19 91.28,86.05 91.28,85.89 91.27,85.58 91.27,85.27 89.54,85.27 89.5,84.64 89.49,83.99 89.48,83.32 89.48,82.65 89.49,81.97 89.49,81.3 89.5,80.63 89.49,79.96 88.06,79.96 88.06,85.27 86.27,85.27 86.27,86.45
N$53  (via drill 0.6)
  Top 0.406: v82.56,4.83 40.14,4.83 35.06,9.91 35.06,13.97 32.52,16.51 26.43,16.51 25.41,17.53 25.41,19.3 v28.46,22.35
  Bottom 0.406: C9.1 32.39,26.78 VR1.4 VR1.2 v28.46,22.35 | S3.3 89.91,12.17 v82.56,4.83
N$54
  Top 0.406: S2.P$1 20.45,18.66 U1.3
N$55
  Bottom 0.406: R11.1 110.14,37.96 Q1.4 Q1.2
N$56
  Bottom 0.406: Q1.1 112.47,23.48 R12.2 108.58,23.43 R10.2
N$57
  cutout Route2: 41.16,96.01 45.22,96.01 45.22,91.95 41.16,91.95
N$58
  cutout Route2: 89.62,22.56 89.62,20.62 89.32,20.65 88.96,20.83 88.78,21.06 88.61,21.36 88.61,21.64 88.66,21.92 88.81,22.15 89.01,22.35 89.27,22.48 89.57,22.56
N$59
  cutout Route2: 8.16,17.5 8.16,15.57 8.42,15.62 8.67,15.77 8.93,16 9.08,16.26 9.08,16.54 9.03,16.81 8.9,17.04 8.75,17.22 8.6,17.32 8.37,17.42
N$60
  cutout Route2: 102.63,22.61 102.63,20.68 102.32,20.7 101.97,20.88 101.79,21.11 101.61,21.41 101.61,21.69 101.66,21.97 101.81,22.2 102.02,22.4 102.27,22.53 102.58,22.61
N$61
  cutout Route2: 24.14,38.86 24.14,39.37 24.65,39.37 24.14,39.37
N$62
  cutout Route2: 26.68,39.37 27.19,39.37 27.19,38.86 27.19,39.37
N$63
  cutout Route2: 24.65,33.27 24.14,33.27 24.14,33.78 24.14,33.27
N$64
  cutout Route2: 26.68,33.27 27.19,33.27 27.19,33.78 27.19,33.27
N$65
  cutout Route2: 88.4,28.45 89.42,28.45 89.42,27.43 89.42,28.45
N$66
  cutout Route2: 88.4,14.73 89.42,14.73 89.42,15.75 89.42,14.73
N$67
  cutout Route2: 102.63,23.37 102.63,24.13 101.86,24.13 102.63,24.13
N$68
  cutout Route2: 102.63,19.81 102.63,19.05 101.86,19.05 102.63,19.05
N$69
  cutout Route2: 92.72,23.37 92.72,24.13 93.48,24.13 92.72,24.13
N$70
  cutout Route2: 38.62,28.45 37.6,28.45 37.6,27.43 37.6,28.45
N$71
  cutout Route2: 38.62,14.73 37.6,14.73 37.6,15.75 37.6,14.73
N$72
  cutout Route2: 18.3,18.29 18.3,19.05 17.54,19.05 18.3,19.05
N$73
  cutout Route2: 18.3,14.73 18.3,13.97 17.54,13.97 18.3,13.97
N$74
  cutout Route2: 8.14,14.73 8.14,13.97 8.9,13.97 8.14,13.97
N$75
  cutout Route2: 8.14,18.29 8.14,19.05 8.9,19.05 8.14,19.05
N$76
  cutout Route2: 92.72,19.81 92.72,19.05 93.48,19.05 92.72,19.05
N$77
  pour Route15: 63.44,116.71 63.44,116.84 63.48,116.78 63.51,116.84 63.52,116.71 80.32,87.72 46.63,87.72
N$78
  pour Route15: 77,107.52 89.45,87.72 83.57,87.72 74.21,102.76
N$79
  pour Route15: 49.96,107.52 37.5,87.72 43.39,87.72 52.75,102.76
N$80
  cutout Route15: 38.69,26.37 38.79,26.33 38.92,26.31 39.31,26.31 39.31,26.8 38.92,26.8 38.79,26.79 38.69,26.74 38.66,26.71 38.63,26.67 38.62,26.62 38.61,26.56 38.62,26.5 38.63,26.45 38.66,26.4
N$81
  pour Route15: 38.02,26.2 37.97,26.29 37.93,26.38 37.91,26.48 37.9,26.59 37.92,26.74 37.96,26.87 38.03,26.98 38.12,27.08 38.25,27.15 38.4,27.21 38.57,27.24 38.77,27.25 39.99,27.25 39.99,24.86 39.31,24.86 39.31,25.84 39.01,25.84 38.68,24.86 37.92,24.86 38.36,25.97 38.25,26.01 38.16,26.06 38.08,26.13
N$82
  cutout Route15: 41.4,25.3 41.5,25.31 41.59,25.35 41.66,25.41 41.72,25.49 41.76,25.6 41.8,25.73 41.82,25.88 41.82,26.06 41.82,26.23 41.8,26.39 41.76,26.52 41.72,26.63 41.66,26.71 41.59,26.77 41.5,26.8 41.4,26.82 41.31,26.8 41.22,26.77 41.15,26.71 41.09,26.63 41.04,26.52 41.01,26.39 40.99,26.23 40.98,26.06 40.99,25.88 41.01,25.73 41.04,25.6 41.09,25.49 41.15,25.41 41.22,25.35 41.31,25.31
N$83
  pour Route15: 40.58,26.95 40.66,27.03 40.75,27.1 40.84,27.16 40.94,27.2 41.05,27.24 41.16,27.27 41.28,27.29 41.4,27.29 41.53,27.29 41.65,27.27 41.76,27.24 41.87,27.2 41.97,27.16 42.06,27.1 42.15,27.03 42.22,26.95 42.29,26.87 42.36,26.78 42.41,26.67 42.45,26.56 42.49,26.44 42.51,26.32 42.53,26.19 42.53,26.05 42.53,25.91 42.51,25.78 42.49,25.65 42.45,25.53 42.41,25.42 42.36,25.32 42.29,25.23 42.22,25.14 42.15,25.07 42.06,25 41.97,24.94 41.87,24.89 41.76,24.86 41.65,24.83 41.53,24.81 41.4,24.81 41.28,24.81 41.16,24.83 41.05,24.86 40.94,24.89 40.84,24.94 40.75,25 40.66,25.07 40.58,25.14 40.51,25.23 40.45,25.32 40.4,25.42 40.35,25.53 40.32,25.65 40.29,25.78 40.28,25.91 40.27,26.05 40.28,26.19 40.29,26.32 40.32,26.44 40.35,26.56 40.4,26.67 40.45,26.78 40.51,26.87
N$84
  pour Route15: 44.64,26.74 44,26.74 44,24.86 43.32,24.86 43.32,26.74 42.65,26.74 42.65,27.25 44.64,27.25
N$85
  pour Route15: 44.92,26.08 45.12,26.23 45.41,26.34 45.69,26.41 45.9,26.46 46.03,26.53 46.07,26.63 46.05,26.71 46,26.77 45.9,26.81 45.78,26.82 45.63,26.81 45.5,26.76 45.38,26.69 45.28,26.58 44.89,26.91 44.97,27 45.06,27.08 45.15,27.14 45.26,27.2 45.37,27.24 45.49,27.27 45.62,27.29 45.75,27.29 45.97,27.28 46.16,27.23 46.32,27.16 46.46,27.07 46.57,26.96 46.65,26.82 46.7,26.67 46.72,26.5 46.71,26.37 46.68,26.26 46.63,26.15 46.55,26.06 46.46,25.98 46.34,25.91 46.21,25.85 46.06,25.8 45.79,25.74 45.59,25.69 45.47,25.62 45.43,25.52 45.45,25.43 45.52,25.36 45.64,25.31 45.79,25.29 45.96,25.31 46.12,25.37 46.27,25.46 46.41,25.59 46.83,25.27 46.73,25.16 46.63,25.07 46.51,24.99 46.39,24.92 46.26,24.87 46.12,24.84 45.98,24.82 45.82,24.81 45.59,24.83 45.38,24.87 45.2,24.94 45.05,25.04 44.93,25.16 44.84,25.3 44.78,25.46 44.77,25.64 44.81,25.89
N$86
  pour Route15: 47.8,24.86 47.13,24.86 47.13,27.25 47.8,27.25
N$87
  pour Route15: 48.28,26.08 48.48,26.23 48.77,26.34 49.05,26.41 49.26,26.46 49.39,26.53 49.43,26.63 49.41,26.71 49.36,26.77 49.26,26.81 49.14,26.82 48.99,26.81 48.86,26.76 48.74,26.69 48.64,26.58 48.25,26.91 48.33,27 48.42,27.08 48.51,27.14 48.62,27.2 48.73,27.24 48.85,27.27 48.98,27.29 49.11,27.29 49.33,27.28 49.52,27.23 49.68,27.16 49.82,27.07 49.93,26.96 50.01,26.82 50.06,26.67 50.08,26.5 50.07,26.37 50.04,26.26 49.99,26.15 49.91,26.06 49.82,25.98 49.7,25.91 49.57,25.85 49.42,25.8 49.15,25.74 48.95,25.69 48.83,25.62 48.79,25.52 48.81,25.43 48.88,25.36 49,25.31 49.15,25.29 49.32,25.31 49.48,25.37 49.63,25.46 49.77,25.59 50.19,25.27 50.09,25.16 49.99,25.07 49.87,24.99 49.75,24.92 49.62,24.87 49.48,24.84 49.34,24.82 49.18,24.81 48.95,24.83 48.74,24.87 48.56,24.94 48.41,25.04 48.29,25.16 48.2,25.3 48.14,25.46 48.13,25.64 48.16,25.89
N$88
  pour Route15: 50.98,26.03 51.83,27.25 52.46,27.25 52.46,24.86 51.94,24.86 51.94,26.18 50.98,24.86 50.46,24.86 50.46,27.25 50.98,27.25
N$89
  cutout Route15: 54.05,25.82 53.8,26.58 53.56,25.82
N$90
  pour Route15: 54.11,27.25 54.91,24.86 54.36,24.86 54.21,25.31 53.42,25.31 53.28,24.86 52.57,24.86 53.36,27.25
N$91
  cutout Route15: 55.72,26.37 55.82,26.33 55.96,26.31 56.34,26.31 56.34,26.8 55.96,26.8 55.82,26.79 55.73,26.74 55.69,26.71 55.67,26.67 55.65,26.62 55.65,26.56 55.65,26.5 55.67,26.45 55.69,26.4
N$92
  pour Route15: 54.94,26.59 54.95,26.74 54.99,26.87 55.06,26.98 55.16,27.08 55.28,27.15 55.43,27.21 55.6,27.24 55.8,27.25 57.02,27.25 57.02,24.86 56.34,24.86 56.34,25.84 56.05,25.84 55.71,24.86 54.96,24.86 55.39,25.97 55.29,26.01 55.2,26.06 55.12,26.13 55.05,26.2 55,26.29 54.97,26.38 54.94,26.48
N$93
  pour Route15: 59.23,26.74 58.59,26.74 58.59,24.86 57.91,24.86 57.91,26.74 57.25,26.74 57.25,27.25 59.23,27.25
N$94
  pour Route15: 60.46,25.84 59.75,25.84 59.75,26.33 60.46,26.33 60.46,26.76 59.35,26.76 59.35,27.25 61.14,27.25 61.14,24.86 59.32,24.86 59.32,25.39 60.46,25.39
N$95
  pour Route15: 62.19,26.37 62.87,26.37 62.87,27.25 63.54,27.25 63.54,24.86 62.87,24.86 62.87,25.83 62.19,25.83 62.19,24.86 61.52,24.86 61.52,27.25 62.19,27.25
N$96
  pour Route15: 65.75,26.74 65.11,26.74 65.11,24.86 64.43,24.86 64.43,26.74 63.76,26.74 63.76,27.25 65.75,27.25
N$97
  pour Route15: 66.01,27.29 67.34,24.07 67.06,24.07 65.74,27.29
N$98
  pour Route15: 68.68,26.07 69.08,27.25 70.04,27.25 70.04,24.86 69.51,24.86 69.51,26.55 68.95,24.86 68.55,24.86 68,26.55 68,24.86 67.34,24.86 67.34,27.25 68.29,27.25
N$99
  cutout Route15: 71.45,25.3 71.55,25.31 71.63,25.35 71.71,25.41 71.77,25.49 71.81,25.6 71.84,25.73 71.86,25.88 71.87,26.06 71.86,26.23 71.84,26.39 71.81,26.52 71.77,26.63 71.71,26.71 71.63,26.77 71.55,26.8 71.45,26.82 71.35,26.8 71.27,26.77 71.19,26.71 71.14,26.63 71.09,26.52 71.06,26.39 71.04,26.23 71.03,26.06 71.04,25.88 71.06,25.73 71.09,25.6 71.14,25.49 71.19,25.41 71.27,25.35 71.35,25.31
N$100
  pour Route15: 70.63,26.95 70.71,27.03 70.79,27.1 70.89,27.16 70.99,27.2 71.09,27.24 71.21,27.27 71.33,27.29 71.45,27.29 71.57,27.29 71.69,27.27 71.81,27.24 71.91,27.2 72.01,27.16 72.11,27.1 72.19,27.03 72.27,26.95 72.34,26.87 72.4,26.78 72.46,26.67 72.5,26.56 72.54,26.44 72.56,26.32 72.58,26.19 72.58,26.05 72.58,25.91 72.56,25.78 72.54,25.65 72.5,25.53 72.46,25.42 72.4,25.32 72.34,25.23 72.27,25.14 72.19,25.07 72.11,25 72.01,24.94 71.91,24.89 71.81,24.86 71.69,24.83 71.57,24.81 71.45,24.81 71.33,24.81 71.21,24.83 71.09,24.86 70.99,24.89 70.89,24.94 70.79,25 70.71,25.07 70.63,25.14 70.56,25.23 70.5,25.32 70.45,25.42 70.4,25.53 70.37,25.65 70.34,25.78 70.33,25.91 70.32,26.05 70.33,26.19 70.34,26.32 70.37,26.44 70.4,26.56 70.45,26.67 70.5,26.78 70.56,26.87
N$101
  pour Route15: 73.38,25.4 73.44,25.35 73.51,25.32 73.59,25.3 73.67,25.29 73.78,25.3 73.87,25.34 73.94,25.4 74.01,25.48 74.05,25.59 74.09,25.72 74.11,25.87 74.12,26.05 74.11,26.23 74.09,26.38 74.06,26.5 74.02,26.61 73.96,26.69 73.89,26.74 73.81,26.78 73.71,26.79 73.64,26.78 73.57,26.76 73.52,26.73 73.47,26.69 73.44,26.64 73.41,26.57 73.38,26.48 73.36,26.39 72.74,26.43 72.86,26.8 72.95,26.95 73.06,27.07 73.19,27.17 73.34,27.24 73.51,27.28 73.69,27.3 73.82,27.29 73.94,27.27 74.05,27.24 74.16,27.2 74.26,27.14 74.36,27.08 74.44,27 74.53,26.91 74.59,26.82 74.65,26.72 74.71,26.62 74.75,26.52 74.8,26.29 74.82,26.04 74.81,25.9 74.8,25.76 74.77,25.64 74.74,25.52 74.7,25.41 74.65,25.31 74.59,25.22 74.52,25.13 74.44,25.06 74.36,24.99 74.27,24.94 74.17,24.89 74.06,24.85 73.94,24.83 73.82,24.81 73.69,24.81 73.5,24.82 73.33,24.86 73.17,24.92 73.04,25.01 72.93,25.13 72.83,25.26 72.76,25.43 72.7,25.62 73.21,25.72 73.24,25.62 73.28,25.53 73.32,25.46
N$102
  pour Route15: 75.78,24.86 75.18,24.86 75.18,25.49 75.78,25.49
N$103
  cutout Route15: 76.95,25.38 77,25.35 77.06,25.33 77.14,25.32 77.22,25.32 77.59,25.32 77.59,25.85 77.22,25.85 77.13,25.85 77.06,25.83 77,25.81 76.96,25.78 76.92,25.74 76.89,25.7 76.87,25.64 76.87,25.58 76.87,25.51 76.89,25.46 76.92,25.41
N$104
  cutout Route15: 77.59,26.81 77.28,26.81 77.11,26.8 76.99,26.76 76.92,26.68 76.89,26.56 76.92,26.44 76.99,26.36 77.11,26.32 77.28,26.31 77.59,26.31
N$105
  pour Route15: 76.68,26.11 76.57,26.15 76.48,26.19 76.4,26.25 76.34,26.31 76.29,26.38 76.25,26.46 76.23,26.55 76.22,26.64 76.24,26.78 76.28,26.91 76.35,27.01 76.45,27.1 76.58,27.17 76.74,27.21 76.92,27.24 77.14,27.25 78.25,27.25 78.25,24.86 77.09,24.86 76.87,24.87 76.68,24.9 76.52,24.95 76.39,25.02 76.29,25.11 76.22,25.22 76.17,25.35 76.16,25.5 76.17,25.62 76.19,25.72 76.23,25.81 76.29,25.89 76.36,25.96 76.45,26.02 76.56,26.07
N$106
  pour Route15: 79.17,25.79 79.19,25.57 79.25,25.42 79.36,25.34 79.56,25.31 79.75,25.34 79.86,25.42 79.92,25.57 79.94,25.79 79.94,27.25 80.61,27.25 80.61,25.73 80.6,25.5 80.56,25.31 80.53,25.23 80.49,25.15 80.44,25.08 80.38,25.02 80.32,24.97 80.25,24.93 80.17,24.89 80.08,24.86 79.87,24.82 79.63,24.81 79.39,24.82 79.18,24.86 79.09,24.89 79.01,24.93 78.94,24.97 78.88,25.02 78.82,25.08 78.77,25.15 78.73,25.23 78.7,25.31 78.66,25.5 78.64,25.73 78.64,27.25 79.17,27.25
N$107
  pour Route15: 81.68,26.37 82.35,26.37 82.35,27.25 83.02,27.25 83.02,24.86 82.35,24.86 82.35,25.83 81.68,25.83 81.68,24.86 81,24.86 81,27.25 81.68,27.25
N$108
  pour Route15: 85.23,26.74 84.59,26.74 84.59,24.86 83.91,24.86 83.91,26.74 83.25,26.74 83.25,27.25 85.23,27.25
N$109
  pour Route15: 86.16,24.86 85.49,24.86 85.49,27.25 86.16,27.25
N$110
  pour Route15: 87.57,26.82 87.49,26.81 87.42,26.79 87.36,26.75 87.3,26.7 87.25,26.64 87.22,26.57 87.19,26.48 87.18,26.38 86.53,26.48 86.58,26.67 86.66,26.83 86.76,26.96 86.88,27.08 87.03,27.17 87.19,27.24 87.58,27.29 87.7,27.29 87.82,27.27 87.94,27.24 88.05,27.2 88.15,27.16 88.24,27.1 88.33,27.03 88.4,26.95 88.47,26.87 88.53,26.77 88.58,26.67 88.63,26.55 88.66,26.43 88.68,26.3 88.7,26.16 88.7,26.02 88.7,25.88 88.68,25.75 88.66,25.63 88.63,25.51 88.59,25.41 88.54,25.31 88.48,25.21 88.42,25.13 88.34,25.06 88.26,24.99 88.18,24.94 88.08,24.89 87.98,24.85 87.87,24.83 87.76,24.81 87.63,24.81 87.41,24.82 87.22,24.87 87.14,24.91 87.06,24.96 86.99,25.02 86.93,25.09 86.74,24.86 86.53,24.86 86.53,26.05 87.56,26.05 87.56,25.63 87.17,25.63 87.21,25.49 87.29,25.38 87.41,25.31 87.57,25.29 87.77,25.33 87.9,25.47 87.97,25.71 87.99,26.05 87.99,26.23 87.97,26.39 87.94,26.52 87.89,26.63 87.83,26.71 87.76,26.77 87.67,26.8
N$111
  cutout Route15: 32.92,85 32.8,85.01 32.71,85.04 32.62,85.09 32.56,85.16 32.5,85.25 32.46,85.35 32.44,85.48 32.43,85.62 32.44,85.76 32.46,85.88 32.49,85.99 32.54,86.07 32.61,86.14 32.68,86.18 32.77,86.21 32.88,86.22 33.08,86.22 33.08,85
N$112
  pour Route15: 33.64,86.6 32.97,86.6 32.75,86.59 32.55,86.56 32.38,86.51 32.21,86.41 32.12,86.34 32.05,86.26 31.98,86.17 31.93,86.08 31.89,85.97 31.86,85.86 31.84,85.73 31.84,85.6 31.84,85.48 31.86,85.36 31.89,85.25 31.93,85.14 31.99,85.04 32.05,84.95 32.13,84.87 32.21,84.79 32.37,84.7 32.53,84.64 32.72,84.61 32.92,84.61 33.64,84.61
N$113
  pour Route15: 31.62,86.6 30.13,86.6 30.13,86.18 31.05,86.18 31.05,85.83 30.46,85.83 30.46,85.42 31.05,85.42 31.05,85.04 30.11,85.04 30.11,84.61 31.62,84.61
N$114
  pour Route15: 29.64,85.21 29.4,85.02 29.26,84.98 29.13,84.96 29,84.98 28.9,85.02 28.84,85.08 28.82,85.15 28.86,85.24 28.96,85.29 29.12,85.33 29.35,85.39 29.47,85.42 29.59,85.47 29.68,85.53 29.76,85.6 29.82,85.68 29.86,85.77 29.89,85.86 29.9,85.97 29.84,86.23 29.78,86.35 29.68,86.44 29.43,86.58 29.1,86.63 28.98,86.62 28.88,86.61 28.78,86.58 28.68,86.55 28.6,86.5 28.52,86.45 28.44,86.39 28.38,86.31 28.7,86.03 28.89,86.19 29.11,86.24 29.22,86.22 29.3,86.19 29.34,86.14 29.36,86.08 29.32,85.99 29.22,85.94 29.04,85.89 28.8,85.84 28.57,85.75 28.4,85.62 28.31,85.46 28.27,85.25 28.29,85.1 28.33,84.97 28.41,84.85 28.51,84.75 28.78,84.61 29.15,84.56 29.28,84.57 29.4,84.58 29.52,84.61 29.62,84.65 29.73,84.71 29.82,84.77 29.91,84.85 29.99,84.94
N$115
  pour Route15: 28,86.6 27.44,86.6 27.44,84.61 28,84.61
N$116
  pour Route15: 25.7,84.79 25.81,84.69 25.95,84.61 26.11,84.57 26.29,84.56 26.49,84.57 26.66,84.63 26.81,84.71 26.94,84.83 27.04,84.97 27.12,85.15 27.16,85.34 27.18,85.57 27.16,85.8 27.12,86.01 27.04,86.2 26.93,86.35 26.87,86.41 26.79,86.47 26.72,86.52 26.63,86.56 26.45,86.61 26.24,86.63 25.92,86.58 25.66,86.45 25.48,86.24 25.37,85.95 25.91,85.87 25.92,85.95 25.94,86.02 25.97,86.09 26.01,86.14 26.06,86.18 26.11,86.21 26.17,86.22 26.24,86.23 26.32,86.22 26.39,86.19 26.46,86.14 26.5,86.07 26.54,85.98 26.57,85.87 26.58,85.74 26.59,85.59 26.57,85.31 26.51,85.11 26.4,85 26.24,84.96 26.11,84.98 26,85.03 25.93,85.12 25.9,85.24 26.22,85.24 26.22,85.59 25.37,85.59 25.37,84.61 25.55,84.61
N$117
  pour Route15: 25.09,86.6 24.56,86.6 23.85,85.58 23.85,86.6 23.42,86.6 23.42,84.61 23.85,84.61 24.65,85.7 24.65,84.61 25.09,84.61
N$118
  pour Route15: 23.1,86.6 21.61,86.6 21.61,86.18 22.54,86.18 22.54,85.83 21.95,85.83 21.95,85.42 22.54,85.42 22.54,85.04 21.59,85.04 21.59,84.61 23.1,84.61
N$119
  cutout Route15: 20.65,85 20.54,85.01 20.45,85.04 20.36,85.09 20.29,85.16 20.24,85.25 20.2,85.35 20.18,85.48 20.17,85.62 20.18,85.76 20.2,85.88 20.23,85.99 20.28,86.07 20.34,86.14 20.42,86.18 20.51,86.21 20.62,86.22 20.82,86.22 20.82,85
N$120
  pour Route15: 21.38,86.6 20.71,86.6 20.49,86.59 20.29,86.56 20.11,86.51 19.95,86.41 19.86,86.34 19.78,86.26 19.72,86.17 19.67,86.08 19.63,85.97 19.6,85.86 19.58,85.73 19.58,85.6 19.58,85.48 19.6,85.36 19.63,85.25 19.67,85.14 19.72,85.04 19.79,84.95 19.86,84.87 19.95,84.79 20.1,84.7 20.27,84.64 20.46,84.61 20.66,84.61 21.38,84.61
N$121
  cutout Route15: 17.56,84.99 17.42,85 17.33,85.04 17.3,85.07 17.28,85.1 17.27,85.15 17.26,85.2 17.27,85.25 17.28,85.3 17.3,85.34 17.33,85.37 17.42,85.41 17.55,85.43 17.86,85.43 17.86,84.99
N$122
  cutout Route15: 17.6,85.81 17.46,85.82 17.36,85.86 17.3,85.92 17.28,86.02 17.3,86.12 17.36,86.18 17.46,86.22 17.6,86.23 17.86,86.23 17.86,85.81
N$123
  pour Route15: 18.41,86.6 17.48,86.6 17.3,86.59 17.15,86.56 17.02,86.52 16.91,86.47 16.83,86.4 16.77,86.31 16.74,86.21 16.72,86.09 16.73,86.01 16.75,85.94 16.78,85.87 16.82,85.81 16.87,85.76 16.94,85.72 17.02,85.68 17.1,85.64 17,85.61 16.91,85.57 16.84,85.52 16.78,85.47 16.73,85.4 16.69,85.32 16.67,85.23 16.67,85.14 16.68,85.01 16.72,84.9 16.78,84.81 16.86,84.73 16.97,84.68 17.1,84.64 17.26,84.61 17.44,84.61 18.41,84.61
N$124
  pour Route15: 15.98,85.44 16.7,86.6 16.05,86.6 15.65,85.93 15.25,86.6 14.74,86.6 15.42,85.5 15.42,84.61 15.98,84.61
N$125
  cutout Route15: 26.66,81.65 26.82,81.79 26.99,81.84 27.09,81.83 27.18,81.79 27.25,81.73 27.3,81.65 27.34,81.55 27.37,81.42 27.38,81.26 27.39,81.08 27.39,80.91 27.37,80.76 27.34,80.63 27.3,80.53 27.25,80.45 27.19,80.39 27.1,80.36 27.01,80.34 26.91,80.35 26.82,80.39 26.74,80.44 26.66,80.52
N$126
  pour Route15: 25.79,80.11 25.79,79.98 25.76,79.86 26.66,79.86 26.66,80.1 26.83,79.97 27.01,79.88 27.19,79.82 27.37,79.8 27.47,79.81 27.57,79.82 27.66,79.85 27.75,79.89 27.83,79.94 27.91,79.99 27.98,80.06 28.04,80.14 28.1,80.22 28.15,80.32 28.2,80.42 28.23,80.54 28.28,80.79 28.3,81.07 28.28,81.35 28.23,81.6 28.19,81.72 28.15,81.82 28.09,81.92 28.03,82.01 27.97,82.09 27.89,82.16 27.82,82.22 27.73,82.27 27.64,82.31 27.55,82.33 27.45,82.35 27.35,82.36 27.26,82.35 27.16,82.34 27.07,82.31 26.99,82.28 26.82,82.18 26.66,82.04 26.66,83.36 25.79,83.36
N$127
  pour Route15: 24.85,80.92 24.76,80.81 24.67,80.71 24.57,80.62 24.46,80.55 24.35,80.5 24.24,80.46 24.12,80.44 23.99,80.43 23.78,80.46 23.62,80.55 23.52,80.68 23.48,80.84 23.52,81.05 23.66,81.19 23.89,81.27 24.22,81.29 24.48,81.29 24.48,81.96 24.24,81.96 24.09,81.97 23.96,81.99 23.85,82.02 23.76,82.07 23.7,82.12 23.65,82.2 23.62,82.28 23.61,82.39 23.62,82.46 23.64,82.53 23.67,82.59 23.72,82.64 23.78,82.68 23.85,82.71 23.93,82.73 24.03,82.73 24.23,82.71 24.43,82.64 24.61,82.51 24.8,82.34 25.34,82.85 25.2,82.97 25.05,83.08 24.89,83.18 24.71,83.25 24.53,83.31 24.33,83.36 24.13,83.38 23.92,83.39 23.63,83.38 23.37,83.33 23.15,83.25 22.96,83.15 22.89,83.09 22.82,83.02 22.76,82.94 22.71,82.86 22.67,82.78 22.64,82.69 22.63,82.6 22.62,82.5 22.66,82.24 22.78,82.02 22.98,81.85 23.27,81.7 23.08,81.64 22.92,81.56 22.78,81.47 22.67,81.37 22.58,81.26 22.52,81.13 22.49,80.99 22.47,80.84 22.48,80.72 22.5,80.61 22.53,80.5 22.57,80.4 22.63,80.3 22.69,80.22 22.77,80.13 22.86,80.06 22.96,79.99 23.07,79.93 23.18,79.88 23.31,79.84 23.45,79.81 23.6,79.78 23.76,79.77 23.92,79.76 24.18,79.77 24.42,79.81 24.64,79.86 24.84,79.94 25.02,80.03 25.18,80.16 25.33,80.3 25.46,80.48
N$128
  pour Route15: 19.75,80.66 19.82,80.46 19.91,80.29 20.03,80.14 20.17,80.01 20.33,79.91 20.51,79.84 20.7,79.8 20.92,79.78 21.05,79.79 21.18,79.8 21.31,79.83 21.42,79.87 21.53,79.92 21.63,79.98 21.73,80.05 21.81,80.12 21.89,80.21 21.95,80.31 22.01,80.41 22.06,80.53 22.1,80.65 22.13,80.78 22.14,80.92 22.15,81.06 22.14,81.21 22.13,81.35 22.1,81.48 22.06,81.6 22.01,81.72 21.95,81.83 21.88,81.93 21.8,82.02 21.72,82.1 21.62,82.17 21.52,82.23 21.41,82.28 21.3,82.32 21.17,82.35 21.05,82.37 20.91,82.38 20.71,82.36 20.52,82.32 20.35,82.25 20.2,82.15 20.06,82.03 19.95,81.88 19.86,81.7 19.8,81.51 20.57,81.45 20.61,81.61 20.67,81.72 20.71,81.76 20.76,81.78 20.81,81.8 20.87,81.81 21.05,81.76 21.16,81.64 21.22,81.42 21.24,81.11 21.22,80.77 21.15,80.54 21.03,80.39 20.83,80.35 20.75,80.35 20.68,80.37 20.61,80.41 20.55,80.46 20.49,80.52 20.44,80.59 20.4,80.68 20.36,80.78
N$129
  cutout Route15: 18.02,81.27 18.02,82.4 18.88,81.27
N$130
  pour Route15: 18.04,80.6 19.58,80.6 19.58,81.27 17.95,83.33 17.07,83.33 17.07,81.27 16.5,81.27 16.5,80.6 17.07,80.6 17.07,79.86 18.04,79.86
N$131
  pour Route15: 16.01,81.78 16.35,81.78 16.35,82.32 15.99,82.32 16,82.43 16,82.54 15.96,82.94 15.91,83.08 15.83,83.2 15.73,83.29 15.6,83.35 15.23,83.4 15,83.38 14.74,83.34 14.74,82.8 14.81,82.81 14.88,82.81 14.99,82.8 15.07,82.76 15.11,82.7 15.13,82.62 15.13,82.32 14.74,82.32 14.74,81.78 15.15,81.78 15.15,79.86 16.01,79.86
N$132
  pour Route15: 69.45,86.34 67.97,86.34 67.97,85.93 68.89,85.93 68.89,85.58 68.31,85.58 68.31,85.18 68.89,85.18 68.89,84.8 67.95,84.8 67.95,84.38 69.45,84.38
N$133
  pour Route15: 67.75,86.34 66.27,86.34 66.27,85.93 67.19,85.93 67.19,85.58 66.61,85.58 66.61,85.18 67.19,85.18 67.19,84.8 66.25,84.8 66.25,84.38 67.75,84.38
N$134
  pour Route15: 65.3,86.34 64.76,86.34 64.49,85.29 64.22,86.34 63.78,86.34 63.52,85.29 63.25,86.34 62.81,86.34 63.33,84.38 63.77,84.38 64.07,85.42 64.35,84.38 64.79,84.38
N$135
  cutout Route15: 62.18,85.36 62.18,85.21 62.16,85.08 62.13,84.98 62.09,84.89 62.05,84.82 61.99,84.77 61.92,84.74 61.84,84.73 61.76,84.74 61.69,84.77 61.63,84.82 61.58,84.89 61.54,84.98 61.51,85.08 61.5,85.21 61.49,85.36 61.5,85.5 61.51,85.63 61.54,85.74 61.58,85.83 61.63,85.89 61.69,85.94 61.76,85.97 61.84,85.98 61.92,85.97 61.99,85.94 62.05,85.89 62.09,85.83 62.13,85.74 62.16,85.63 62.18,85.5
N$136
  pour Route15: 62.77,85.35 62.75,85.57 62.7,85.77 62.62,85.95 62.51,86.1 62.38,86.21 62.22,86.3 62.04,86.36 61.84,86.37 61.64,86.36 61.46,86.3 61.3,86.21 61.16,86.1 61.05,85.95 60.97,85.77 60.92,85.57 60.91,85.35 60.92,85.13 60.97,84.93 61.05,84.75 61.16,84.6 61.3,84.49 61.46,84.4 61.64,84.34 61.84,84.33 62.04,84.34 62.22,84.4 62.38,84.49 62.51,84.6 62.62,84.75 62.7,84.93 62.75,85.13
N$137
  cutout Route15: 59.8,85.57 59.68,85.58 59.6,85.62 59.58,85.64 59.56,85.68 59.54,85.72 59.54,85.78 59.56,85.86 59.61,85.92 59.69,85.96 59.8,85.97 60.11,85.97 60.11,85.57
N$138
  pour Route15: 60.67,86.34 59.67,86.34 59.5,86.33 59.36,86.31 59.24,86.26 59.13,86.2 59.06,86.12 59,86.03 58.97,85.92 58.95,85.8 58.96,85.71 58.98,85.62 59.01,85.55 59.05,85.48 59.1,85.42 59.17,85.36 59.24,85.32 59.33,85.28 58.97,84.38 59.59,84.38 59.87,85.18 60.11,85.18 60.11,84.38 60.67,84.38
N$139
  pour Route15: 58.69,86.34 58.14,86.34 58.14,85.55 57.55,86.34 57.03,86.34 57.5,85.71 56.89,84.38 57.51,84.38 57.87,85.21 58.14,84.87 58.14,84.38 58.69,84.38
N$140
  pour Route15: 77.98,80.82 78.01,80.67 78.06,80.52 78.12,80.39 78.18,80.27 78.25,80.16 78.33,80.05 78.41,79.96 78.5,79.88 78.6,79.8 78.71,79.74 78.83,79.68 78.95,79.64 79.08,79.6 79.22,79.58 79.36,79.56 79.52,79.56 79.72,79.57 79.91,79.59 80.09,79.63 80.26,79.69 80.41,79.76 80.56,79.85 80.69,79.95 80.81,80.07 80.91,80.2 81.01,80.34 81.09,80.5 81.15,80.67 81.2,80.85 81.24,81.05 81.26,81.25 81.27,81.47 81.26,81.67 81.24,81.87 81.21,82.05 81.16,82.22 81.09,82.38 81.02,82.54 80.92,82.69 80.82,82.83 80.69,82.97 80.55,83.09 80.4,83.2 80.24,83.28 80.07,83.35 79.9,83.4 79.71,83.42 79.51,83.43 79.37,83.43 79.23,83.41 79.1,83.38 78.97,83.34 78.85,83.29 78.74,83.23 78.63,83.16 78.53,83.08 78.44,82.99 78.36,82.89 78.28,82.78 78.21,82.66 78.15,82.53 78.1,82.39 78.06,82.25 78.03,82.09 79.01,82.02 79.03,82.17 79.07,82.3 79.12,82.41 79.18,82.49 79.25,82.56 79.33,82.61 79.43,82.63 79.55,82.64 79.7,82.63 79.83,82.57 79.89,82.53 79.94,82.48 79.99,82.43 80.03,82.36 80.09,82.2 80.14,82 80.17,81.77 80.18,81.5 80.17,81.22 80.13,80.98 80.08,80.77 80.01,80.61 79.91,80.48 79.79,80.39 79.65,80.33 79.49,80.31 79.36,80.32 79.24,80.35 79.13,80.41 79.03,80.48 78.94,80.57 78.87,80.69 78.82,80.82 78.77,80.97
N$141
  cutout Route15: 76.85,80.96 76.85,80.78 76.83,80.62 76.8,80.49 76.76,80.38 76.7,80.29 76.63,80.23 76.54,80.2 76.44,80.19 76.34,80.2 76.25,80.23 76.18,80.29 76.12,80.38 76.08,80.49 76.05,80.62 76.03,80.78 76.02,80.96 76.03,81.14 76.05,81.3 76.08,81.43 76.12,81.54 76.18,81.62 76.25,81.68 76.34,81.71 76.44,81.73 76.54,81.71 76.63,81.68 76.7,81.62 76.76,81.54 76.8,81.43 76.83,81.3 76.85,81.14
N$142
  pour Route15: 77.82,80.95 77.81,81.09 77.79,81.23 77.76,81.37 77.71,81.5 77.66,81.62 77.59,81.73 77.52,81.84 77.43,81.94 77.33,82.02 77.23,82.1 77.11,82.17 76.99,82.22 76.86,82.27 76.73,82.3 76.59,82.32 76.44,82.33 76.29,82.32 76.15,82.3 76.02,82.27 75.89,82.22 75.76,82.17 75.65,82.1 75.55,82.02 75.45,81.94 75.36,81.84 75.29,81.74 75.22,81.62 75.17,81.5 75.12,81.37 75.09,81.24 75.07,81.09 75.06,80.95 75.07,80.8 75.09,80.66 75.12,80.52 75.17,80.39 75.22,80.27 75.29,80.16 75.36,80.05 75.45,79.96 75.55,79.87 75.65,79.79 75.76,79.73 75.89,79.67 76.02,79.63 76.15,79.59 76.29,79.57 76.44,79.57 76.59,79.57 76.73,79.59 76.86,79.63 76.99,79.67 77.11,79.73 77.23,79.79 77.33,79.87 77.43,79.96 77.52,80.05 77.59,80.16 77.66,80.27 77.71,80.39 77.76,80.52 77.79,80.66 77.81,80.8
N$143
  pour Route15: 74.71,82.27 73.82,82.27 73.82,81.89 73.59,82.07 73.36,82.2 73.26,82.25 73.15,82.28 73.03,82.3 72.92,82.3 72.8,82.3 72.7,82.28 72.6,82.24 72.52,82.2 72.44,82.14 72.38,82.07 72.32,81.98 72.28,81.89 72.05,82.07 71.82,82.2 71.6,82.28 71.38,82.3 71.21,82.29 71.06,82.25 70.95,82.18 70.85,82.09 70.78,81.97 70.74,81.82 70.7,81.44 70.7,79.65 71.59,79.65 71.59,81.2 71.6,81.41 71.64,81.56 71.71,81.65 71.84,81.67 72.04,81.62 72.27,81.45 72.27,79.65 73.14,79.65 73.14,81.2 73.15,81.41 73.19,81.56 73.27,81.65 73.4,81.67 73.59,81.62 73.82,81.45 73.82,79.65 74.71,79.65
N$144
  cutout Route15: 69.33,80.37 69.24,80.27 69.14,80.21 69.06,80.17 68.97,80.16 68.87,80.17 68.78,80.21 68.71,80.27 68.64,80.36 68.59,80.48 68.55,80.61 68.53,80.77 68.52,80.95 68.53,81.14 68.55,81.3 68.58,81.44 68.63,81.56 68.69,81.65 68.77,81.72 68.86,81.75 68.96,81.77 69.06,81.75 69.15,81.72 69.24,81.65 69.33,81.56
N$145
  pour Route15: 70.24,82.27 69.33,82.27 69.33,81.99 69.18,82.13 69.01,82.23 68.92,82.26 68.83,82.28 68.74,82.3 68.63,82.3 68.52,82.3 68.41,82.28 68.3,82.25 68.2,82.21 68.11,82.16 68.02,82.1 67.94,82.03 67.87,81.95 67.8,81.86 67.74,81.77 67.69,81.66 67.65,81.55 67.61,81.42 67.59,81.3 67.57,81.16 67.57,81.02 67.57,80.85 67.59,80.69 67.61,80.54 67.64,80.4 67.68,80.27 67.73,80.15 67.78,80.05 67.85,79.95 67.92,79.87 68,79.79 68.09,79.73 68.19,79.68 68.29,79.64 68.4,79.61 68.52,79.59 68.64,79.59 68.84,79.6 69.01,79.66 69.18,79.75 69.33,79.88 69.33,78.75 70.24,78.75
N$146
  pour Route15: 64.69,79.92 64.68,79.78 64.65,79.65 65.59,79.65 65.59,80 65.83,79.82 66.06,79.69 66.28,79.61 66.51,79.59 66.68,79.6 66.82,79.64 66.93,79.71 67.03,79.8 67.1,79.92 67.14,80.07 67.18,80.46 67.18,82.27 66.28,82.27 66.28,80.69 66.27,80.48 66.23,80.33 66.15,80.25 66.02,80.22 65.82,80.28 65.59,80.44 65.59,82.27 64.69,82.27
N$147
  pour Route15: 64.21,83.37 63.32,83.37 63.32,81.31 62.42,82.27 61.52,82.27 62.33,81.42 61.53,79.65 62.53,79.65 63,80.73 63.32,80.4 63.32,79.65 64.21,79.65
N$148
  pour Route15: 61.23,82.27 60.32,82.27 60.32,79.65 61.23,79.65
N$149
  pour Route15: 61.23,83.37 60.32,83.37 60.32,82.61 61.23,82.61
N$150
  cutout Route15: 58.2,81.55 58.37,81.7 58.55,81.75 58.66,81.74 58.75,81.7 58.82,81.64 58.88,81.56 58.92,81.44 58.95,81.3 58.97,81.14 58.97,80.95 58.97,80.76 58.95,80.6 58.92,80.47 58.88,80.36 58.83,80.27 58.76,80.21 58.67,80.18 58.57,80.17 58.46,80.18 58.37,80.21 58.28,80.27 58.2,80.35
N$151
  pour Route15: 57.28,79.92 57.27,79.78 57.24,79.65 58.2,79.65 58.2,79.91 58.38,79.77 58.57,79.67 58.66,79.63 58.76,79.61 58.85,79.59 58.95,79.59 59.06,79.59 59.16,79.61 59.26,79.64 59.35,79.68 59.44,79.73 59.52,79.79 59.6,79.87 59.67,79.95 59.73,80.04 59.78,80.14 59.83,80.25 59.87,80.37 59.9,80.5 59.93,80.64 59.94,80.78 59.94,80.94 59.94,81.09 59.92,81.24 59.9,81.37 59.87,81.5 59.83,81.63 59.78,81.74 59.72,81.84 59.66,81.93 59.59,82.02 59.51,82.09 59.43,82.15 59.34,82.21 59.24,82.25 59.14,82.28 59.04,82.3 58.93,82.3 58.83,82.3 58.73,82.28 58.64,82.26 58.55,82.22 58.37,82.12 58.2,81.97 58.2,83.37 57.28,83.37
N$152
  pour Route15: 56.79,82.27 55.9,82.27 55.9,81.89 55.66,82.07 55.44,82.2 55.33,82.25 55.22,82.28 55.11,82.3 54.99,82.3 54.88,82.3 54.77,82.28 54.68,82.24 54.59,82.2 54.51,82.14 54.45,82.07 54.4,81.98 54.36,81.89 54.12,82.07 53.89,82.2 53.67,82.28 53.45,82.3 53.28,82.29 53.14,82.25 53.02,82.18 52.93,82.09 52.86,81.97 52.81,81.82 52.77,81.44 52.77,79.65 53.66,79.65 53.66,81.2 53.67,81.41 53.71,81.56 53.79,81.65 53.92,81.67 54.11,81.62 54.34,81.45 54.34,79.65 55.22,79.65 55.22,81.2 55.23,81.41 55.26,81.56 55.34,81.65 55.47,81.67 55.67,81.62 55.9,81.45 55.9,79.65 56.79,79.65
N$153
  pour Route15: 52.32,82.27 51.4,82.27 51.4,79.65 52.32,79.65
N$154
  pour Route15: 52.32,83.37 51.4,83.37 51.4,82.61 52.32,82.61
N$155
  pour Route15: 50.93,83.37 50.03,83.37 50.03,81.31 49.14,82.27 48.23,82.27 49.04,81.42 48.24,79.65 49.25,79.65 49.71,80.73 50.03,80.4 50.03,79.65 50.93,79.65
N$156
  cutout Route15: 46.26,81.27 46.26,81.38 46.28,81.48 46.32,81.57 46.37,81.65 46.43,81.7 46.5,81.75 46.58,81.77 46.67,81.78 46.76,81.77 46.84,81.75 46.91,81.71 46.96,81.65 47.01,81.58 47.04,81.49 47.06,81.39 47.07,81.27
N$157